# EAGLE schematic cw-lite-main (EAGLE 9.5.0)
ChipWhisperer-Lite ChipWhisperer-Lite is a side-channel analysis and gltiching platform for embedded security research. ChipWhisperer-Lite is a product of NewAE Technology Inc.
REV: -03
Assembly variants: normal

## Sheet 1 of 8
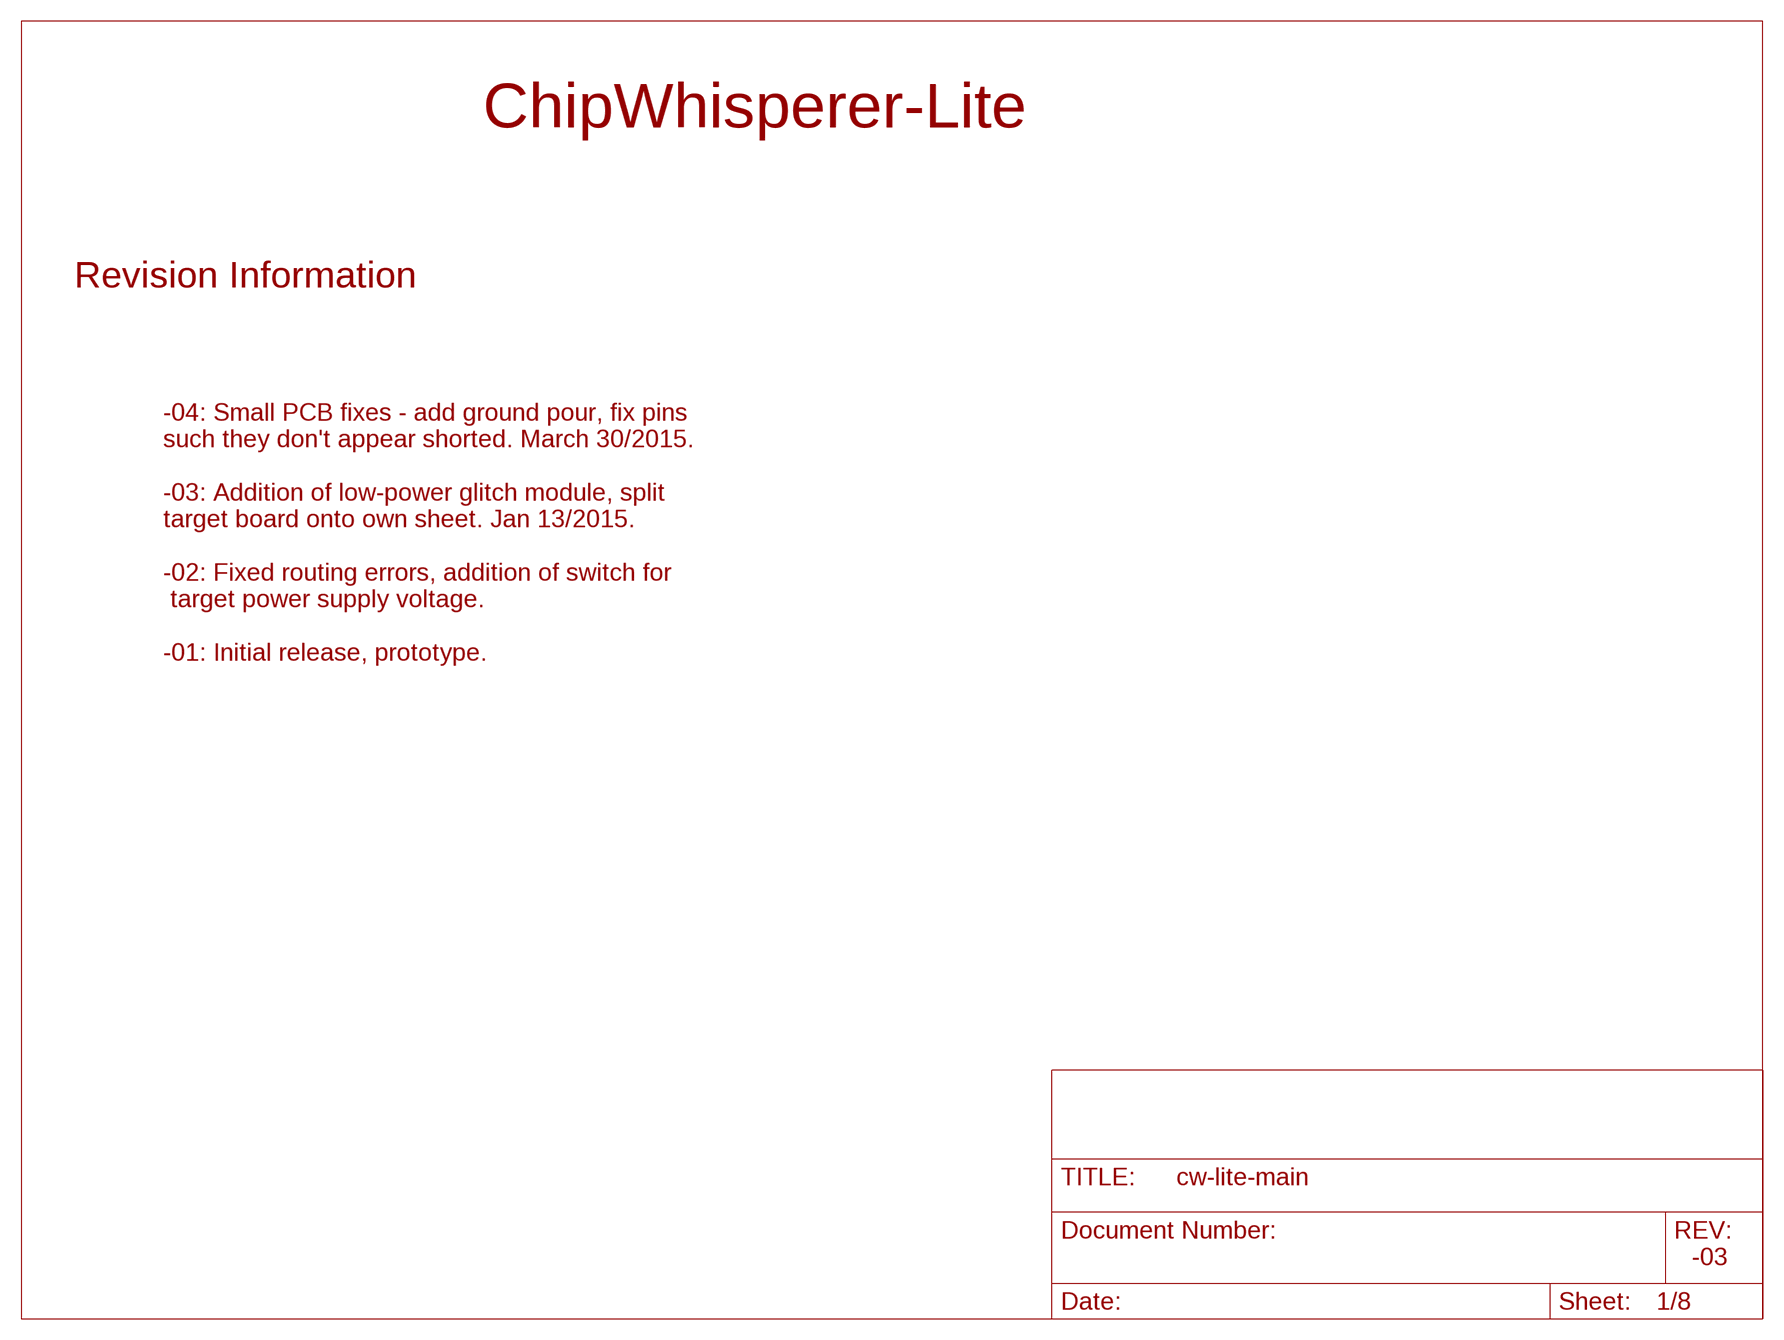
[diagram p0: schematic, sheet 1]

### Notes on the sheet
- ChipWhisperer-Lite
- Revision Information
- -04: Small PCB fixes - add ground pour, fix pins
  such they don't appear shorted. March 30/2015.
  
  -03: Addition of low-power glitch module, split
  target board onto own sheet. Jan 13/2015.
  
  -02: Fixed routing errors, addition of switch for
   target power supply voltage.
  
  -01: Initial release, prototype.

## Sheet 2 of 8
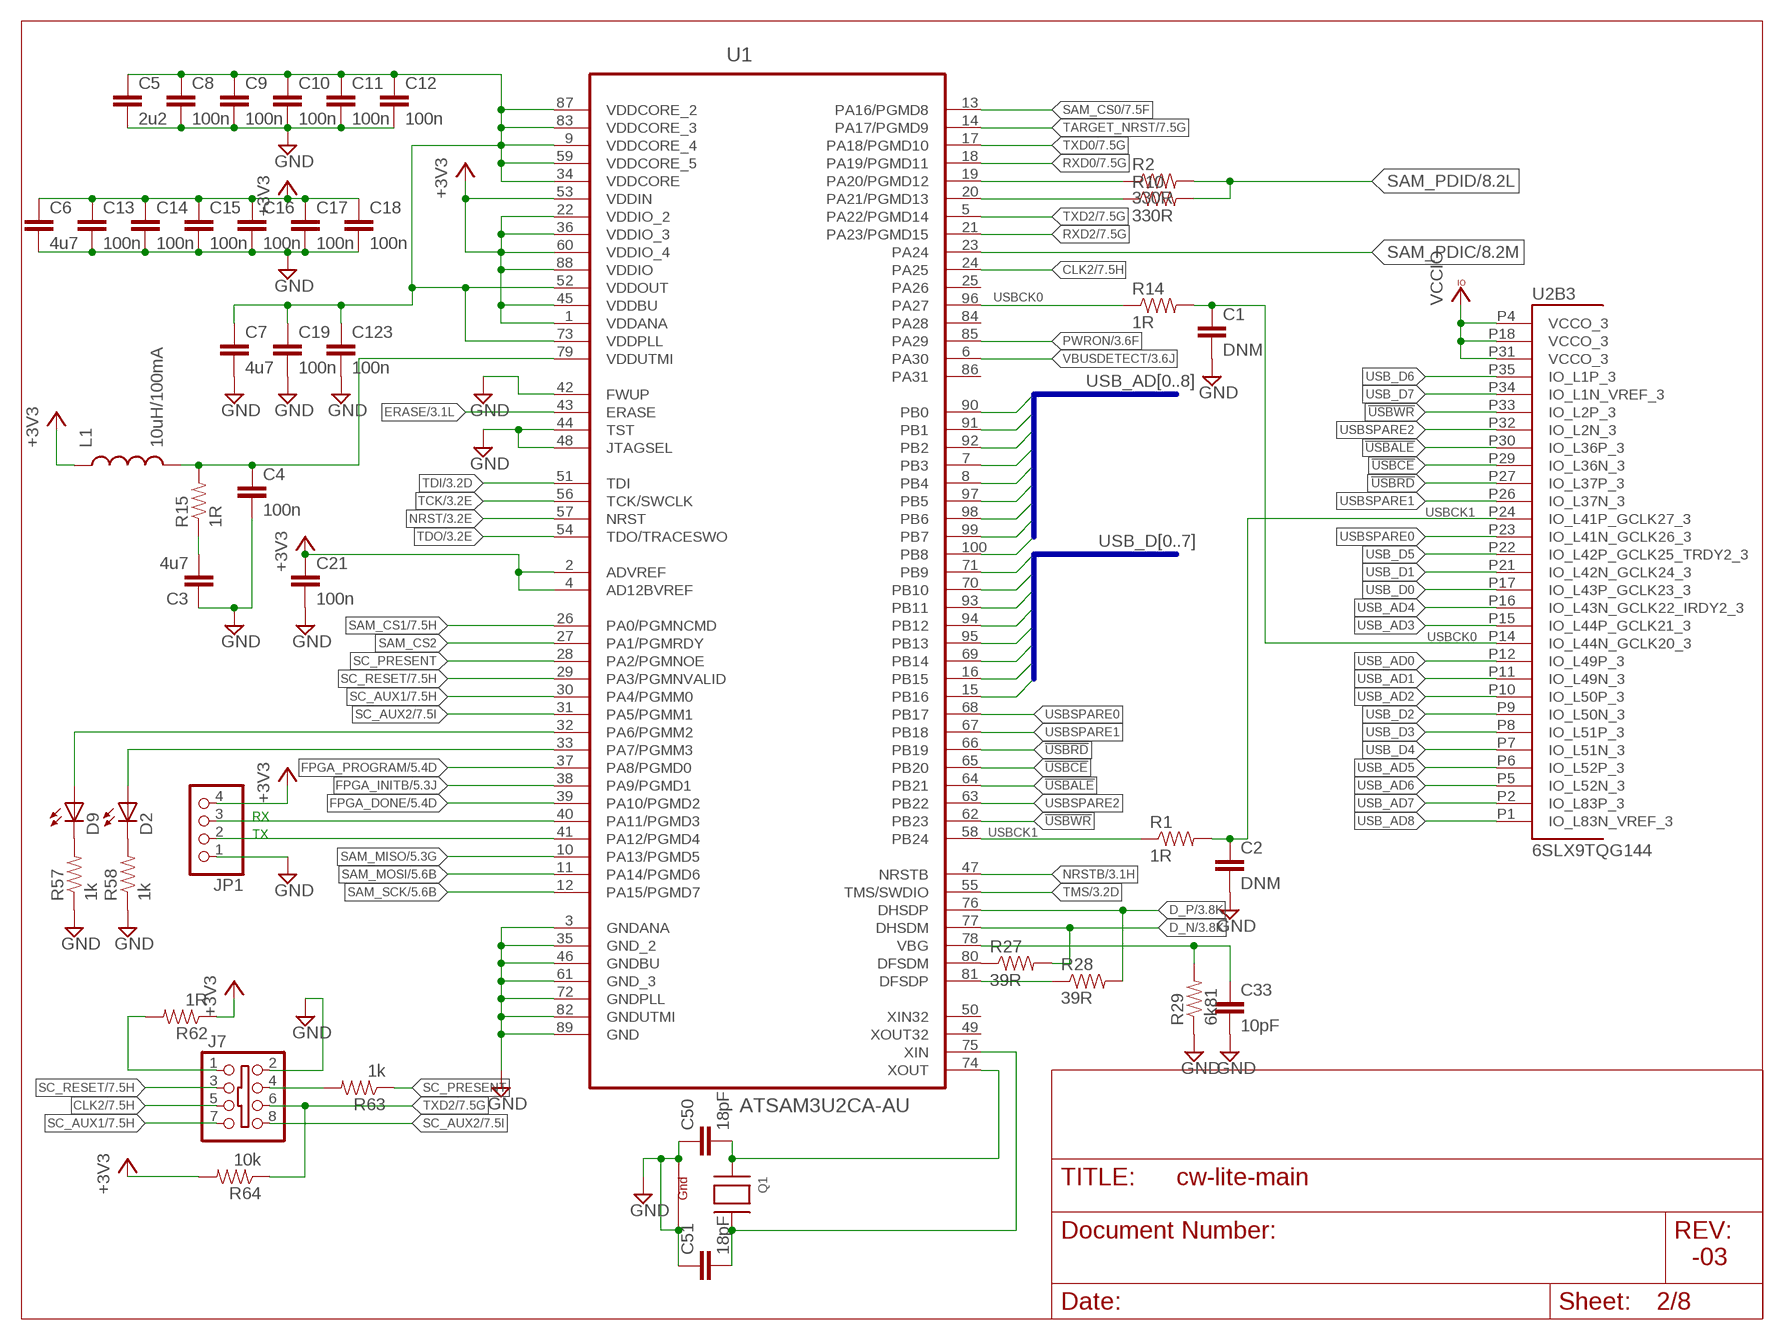
[diagram p1: schematic, sheet 2]

### Parts
C1  DNM  CAP0402-CAP  [0402C]  (not fitted in variant normal)
C2  DNM  CAP0402-CAP  [0402C]  (not fitted in variant normal)
C3  4u7  CAP0603-CAP  [0603C]
C4  100n  CAP0402-CAP  [0402C]
C5  2u2  CAP0603-CAP  [0603C]
C6  4u7  CAP0603-CAP  [0603C]
C7  4u7  CAP0603-CAP  [0603C]
C8  100n  CAP0402-CAP  [0402C]
C9  100n  CAP0402-CAP  [0402C]
C10  100n  CAP0402-CAP  [0402C]
C11  100n  CAP0402-CAP  [0402C]
C12  100n  CAP0402-CAP  [0402C]
C13  100n  CAP0402-CAP  [0402C]
C14  100n  CAP0402-CAP  [0402C]
C15  100n  CAP0402-CAP  [0402C]
C16  100n  CAP0402-CAP  [0402C]
C17  100n  CAP0402-CAP  [0402C]
C18  100n  CAP0402-CAP  [0402C]
C19  100n  CAP0402-CAP  [0402C]
C21  100n  CAP0402-CAP  [0402C]
C33  10pF  CAP0603-CAP  [0603C]
C50  18pF  CAP0402-CAP  [0402C]
C51  18pF  CAP0402-CAP  [0402C]
C123  100n  CAP0402-CAP  [0402C]
D2  LED0603  [LED-0603]
D9  LED0603  [LED-0603]
J7  SHROUD_2X4EDGE  [PINSHRD_EDGE_2X04.PAC]  (not fitted in variant normal)
JP1  PINHD-1X4  [1X04]  (not fitted in variant normal)
L1  10uH/100mA  INDUCTOR0603  [0603]
Q1  XTAL-4ABM8G  [NX3225]
R1  1R  RES0402-RES  [0402R]
R2  330R  RES0402-RES  [0402R]
R10  330R  RES0402-RES  [0402R]
R14  1R  RES0402-RES  [0402R]
R15  1R  RES0603-RES  [0603R]
R27  39R  RES0603-RES  [0603R]
R28  39R  RES0603-RES  [0603R]
R29  6k81  RES0402-RES  [0402R]
R57  1k  RES0603-RES  [0603R]
R58  1k  RES0603-RES  [0603R]
R62  1R  RES0603-RES  [0603R]
R63  1k  RES0603-RES  [0603R]
R64  10k  RES0603-RES  [0603R]
U1  ATSAM3U2CA-AU  [QFP50P1600X1600X160-100N]
U2  6SLX9TQG144  [TQ144]

### Nets
!USBALE: U1.64(PB21) U2.P30(B3:IO_L36P_3)
!USBCE: U1.65(PB20) U2.P29(B3:IO_L36N_3)
!USBRD: U1.66(PB19) U2.P27(B3:IO_L37P_3)
!USBWR: U1.62(PB23) U2.P33(B3:IO_L2P_3)
+3V3 [power]: C6.1 C13.1 C14.1 C15.1 C16.1 C17.1 C18.1 C21.1 JP1.4 L1.1 R62.1 R64.2 U1.1(VDDANA) U1.2(ADVREF) U1.4(AD12BVREF) U1.22(VDDIO_2) U1.36(VDDIO_3) U1.45(VDDBU) U1.53(VDDIN) U1.60(VDDIO_4) U1.88(VDDIO) ; also sheet 3,4
CLK2: J7.5 U1.24(PA25) ; also sheet 7
D_N [USB Differential]: R27.2 U1.77(DHSDM) ; also sheet 3
D_P [USB Differential]: R28.2 U1.76(DHSDP) ; also sheet 3
ERASE: U1.43(ERASE) ; also sheet 3
FPGA_DONE: U1.39(PA10/PGMD2) ; also sheet 5
FPGA_INITB: U1.38(PA9/PGMD1) ; also sheet 5
FPGA_PROGRAM: U1.37(PA8/PGMD0) ; also sheet 5
GND: C1.2 C2.2 C3.1 C4.2 C5.2 C6.2 C7.2 C8.2 C9.2 C10.2 C11.2 C12.2 C13.2 C14.2 C15.2 C16.2 C17.2 C18.2 C19.2 C21.2 C33.2 C50.1 C51.1 C123.2 J7.2 JP1.1 Q1.2(G1) Q1.4(G2) R29.1 R57.1 R58.1 U1.3(GNDANA) U1.35(GND_2) U1.42(FWUP) U1.44(TST) U1.46(GNDBU) U1.48(JTAGSEL) U1.61(GND_3) U1.72(GNDPLL) U1.82(GNDUTMI) U1.89(GND) ; also sheet 3,4,5,6,7,8
N$1: R14.1 U1.96(PA27)
N$2: JP1.3 U1.40(PA11/PGMD3)
N$3: R1.1 U1.58(PB24)
N$4: JP1.2 U1.41(PA12/PGMD4)
N$6: R2.1 U1.19(PA20/PGMD12)
N$13: R10.1 U1.20(PA21/PGMD13)
N$17: C3.2 R15.1
N$18: C4.1 L1.2 R15.2 U1.79(VDDUTMI)
N$23: R27.1 U1.80(DFSDM)
N$25 [power]: C5.1 C7.1 C8.1 C9.1 C10.1 C11.1 C12.1 C19.1 C123.1 U1.9(VDDCORE_4) U1.34(VDDCORE) U1.52(VDDOUT) U1.59(VDDCORE_5) U1.73(VDDPLL) U1.83(VDDCORE_3) U1.87(VDDCORE_2)
N$26: R28.1 U1.81(DFSDP)
N$28: C33.1 R29.2 U1.78(VBG)
N$100: C51.2 Q1.3(X2) U1.75(XIN)
N$105: C50.2 Q1.1(X1) U1.74(XOUT)
N$114: D9.A U1.32(PA6/PGMM2)
N$115: D2.A U1.33(PA7/PGMM3)
N$135: D9.C R57.2
N$138: D2.C R58.2
N$139: J7.1 R62.2
N$143: J7.4 R63.2
NRST: U1.57(NRST) ; also sheet 3
NRSTB: U1.47(NRSTB) ; also sheet 3
PWRON: U1.85(PA29) ; also sheet 3
RXD0: U1.18(PA19/PGMD11) ; also sheet 7
RXD2: U1.21(PA23/PGMD15) ; also sheet 7
SAM_CS0: U1.13(PA16/PGMD8) ; also sheet 7
SAM_CS1: U1.26(PA0/PGMNCMD) ; also sheet 7
SAM_CS2: U1.27(PA1/PGMRDY)
SAM_MISO: U1.10(PA13/PGMD5) ; also sheet 5
SAM_MOSI: U1.11(PA14/PGMD6) ; also sheet 5
SAM_PDIC: U1.23(PA24) ; also sheet 8
SAM_PDID: R2.2 R10.2 ; also sheet 8
SAM_SCK: U1.12(PA15/PGMD7) ; also sheet 5
SC_AUX1: J7.7 U1.30(PA4/PGMM0) ; also sheet 7
SC_AUX2: J7.8 U1.31(PA5/PGMM1) ; also sheet 7
SC_PRESENT: R63.1 U1.28(PA2/PGMNOE)
SC_RESET: J7.3 U1.29(PA3/PGMNVALID) ; also sheet 7
TARGET_NRST: U1.14(PA17/PGMD9) ; also sheet 7
TCK: U1.56(TCK/SWCLK) ; also sheet 3
TDI: U1.51(TDI) ; also sheet 3
TDO: U1.54(TDO/TRACESWO) ; also sheet 3
TMS: U1.55(TMS/SWDIO) ; also sheet 3
TXD0: U1.17(PA18/PGMD10) ; also sheet 7
TXD2: J7.6 R64.1 U1.5(PA22/PGMD14) ; also sheet 7
USB_AD0: U1.90(PB0) U2.P12(B3:IO_L49P_3)
USB_AD1: U1.91(PB1) U2.P11(B3:IO_L49N_3)
USB_AD2: U1.92(PB2) U2.P10(B3:IO_L50P_3)
USB_AD3: U1.7(PB3) U2.P15(B3:IO_L44P_GCLK21_3)
USB_AD4: U1.8(PB4) U2.P16(B3:IO_L43N_GCLK22_IRDY2_3)
USB_AD5: U1.97(PB5) U2.P6(B3:IO_L52P_3)
USB_AD6: U1.98(PB6) U2.P5(B3:IO_L52N_3)
USB_AD7: U1.99(PB7) U2.P2(B3:IO_L83P_3)
USB_AD8: U1.100(PB8) U2.P1(B3:IO_L83N_VREF_3)
USB_D0: U1.71(PB9) U2.P17(B3:IO_L43P_GCLK23_3)
USB_D1: U1.70(PB10) U2.P21(B3:IO_L42N_GCLK24_3)
USB_D2: U1.93(PB11) U2.P9(B3:IO_L50N_3)
USB_D3: U1.94(PB12) U2.P8(B3:IO_L51P_3)
USB_D4: U1.95(PB13) U2.P7(B3:IO_L51N_3)
USB_D5: U1.69(PB14) U2.P22(B3:IO_L42P_GCLK25_TRDY2_3)
USB_D6: U1.16(PB15) U2.P35(B3:IO_L1P_3)
USB_D7: U1.15(PB16) U2.P34(B3:IO_L1N_VREF_3)
USBCK0: C1.1 R14.2 U2.P14(B3:IO_L44N_GCLK20_3)
USBCK1: C2.1 R1.2 U2.P24(B3:IO_L41P_GCLK27_3)
USBSPARE0: U1.68(PB17) U2.P23(B3:IO_L41N_GCLK26_3)
USBSPARE1: U1.67(PB18) U2.P26(B3:IO_L37N_3)
USBSPARE2: U1.63(PB22) U2.P32(B3:IO_L2N_3)
VBUSDETECT: U1.6(PA30) ; also sheet 3
VCCIO [power]: U2.P4(B3:VCCO_3) U2.P18(B3:VCCO_3) U2.P31(B3:VCCO_3) ; also sheet 3,4,5,6,7,8
Unconnected: U1.25(PA26) U1.49(XOUT32) U1.50(XIN32) U1.84(PA28) U1.86(PA31)

### Buses
USB_AD[0..8]
USB_D[0..7]

### Notes on the sheet
- RX
- TX

## Sheet 3 of 8
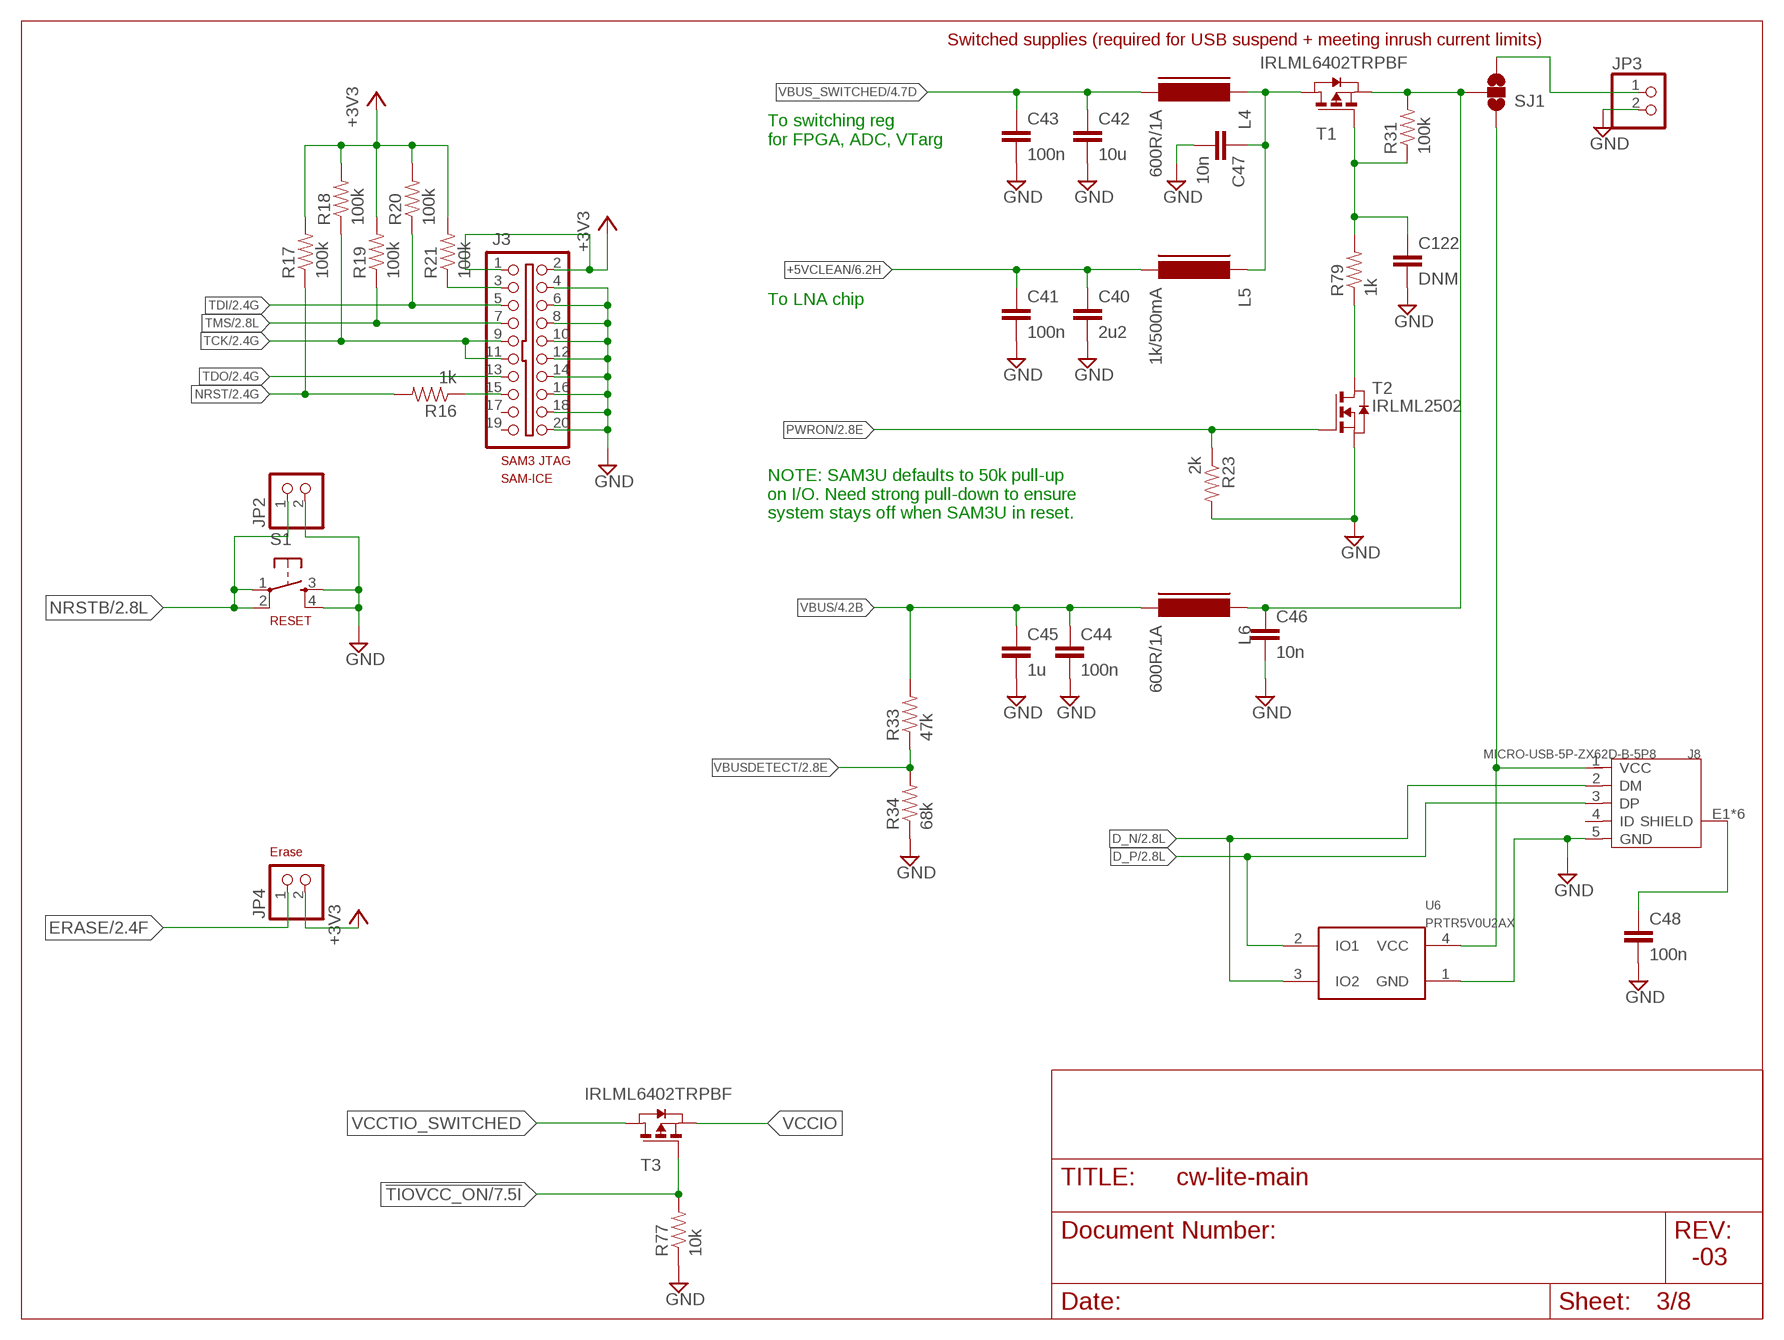
[diagram p2: schematic, sheet 3]

### Parts
C40  2u2  CAP0603-CAP  [0603C]
C41  100n  CAP0603-CAP  [0603C]
C42  10u  CAP0603-CAP  [0603C]
C43  100n  CAP0603-CAP  [0603C]
C44  100n  CAP0603-CAP  [0603C]
C45  1u  CAP0603-CAP  [0603C]
C46  10n  CAP0603-CAP  [0603C]
C47  10n  CAP0603-CAP  [0603C]
C48  100n  CAP0603-CAP  [0603C]
C122  DNM  CAP0603-CAP  [0603C]  (not fitted in variant normal)
J3  SHROUD_2X10-SHROUDED  [PINSHRD_PTH_2X10]  (not fitted in variant normal)
J8  MICRO-USB-5P-ZX62D-B-5P8  [B-SMD-5P-TH]
JP2  PINHD-1X2  [1X02]  (not fitted in variant normal)
JP3  PINHD-1X2  [1X02]  (not fitted in variant normal)
JP4  PINHD-1X2  [1X02]  (not fitted in variant normal)
L4  600R/1A  FERRITE-0603  [FB603]
L5  1k/500mA  FERRITE-0603  [FB603]
L6  600R/1A  FERRITE-0603  [FB603]
R16  1k  RES0402-RES  [0402R]
R17  100k  RES0402-RES  [0402R]
R18  100k  RES0402-RES  [0402R]
R19  100k  RES0402-RES  [0402R]
R20  100k  RES0402-RES  [0402R]
R21  100k  RES0402-RES  [0402R]
R23  2k  RES0603-RES  [0603R]
R31  100k  RES0402-RES  [0402R]
R33  47k  RES0402-RES  [0402R]
R34  68k  RES0402-RES  [0402R]
R77  10k  RES0402-RES  [0402R]
R79  1k  RES0603-RES  [0603R]
S1  TAC_SWITCHSMD  [TACTILE_SWITCH_SMD]  (not fitted in variant normal)
SJ1  SOLDERJUMPER_2WAYPASTE1&2  [SJ_3_PASTE1&2]
T1  IRLML6402TRPBF  PMOSSOT23  [SOT-23]
T2  IRLML2502  NMOSSOT23  [SOT-23]
T3  IRLML6402TRPBF  PMOSSOT23  [SOT-23]
U6  PRTR5V0U2AX  [SOT143B]

### Nets
!TIOVCC_ON: R77.2 T3.3(G) ; also sheet 7
+3V3 [power]: J3.1 J3.2 JP4.2 R17.2 R18.2 R19.2 R20.2 R21.2 ; also sheet 2,4
+5VCLEAN: C40.1 C41.1 L5.2 ; also sheet 6
D_N [USB Differential]: J8.2(DM) U6.3(IO2) ; also sheet 2
D_P [USB Differential]: J8.3(DP) U6.2(IO1) ; also sheet 2
ERASE: JP4.1 ; also sheet 2
GND: C40.2 C41.2 C42.2 C43.2 C44.2 C45.2 C46.2 C47.2 C48.2 C122.2 J3.4 J3.6 J3.8 J3.10 J3.12 J3.14 J3.16 J3.18 J3.20 J8.5(GND) JP2.2 JP3.2 R23.2 R34.1 R77.1 S1.3 S1.4 T2.2(S) U6.1(GND) ; also sheet 2,4,5,6,7,8
N$16: J3.3 R21.1
N$21: J3.15 R16.1
N$27: JP3.1 SJ1.3
N$29: C46.1 L6.1 R31.2 SJ1.2 T1.2(S)
N$31: J8.1(VCC) SJ1.1 U6.4(VCC)
N$32: C47.1 L4.1 L5.1 T1.1(D)
N$33: C122.1 R31.1 R79.2 T1.3(G)
N$34: R79.1 T2.1(D)
N$35: C48.1 J8.E1(SHIELD) J8.E2(SHIELD) J8.P$1(SHIELD) J8.P$2(SHIELD) J8.P$3(SHIELD) J8.P$4(SHIELD)
NRST: R16.2 R17.1 ; also sheet 2
NRSTB: JP2.1 S1.1 S1.2 ; also sheet 2
PWRON: R23.1 T2.3(G) ; also sheet 2
TCK: J3.9 J3.11 R18.1 ; also sheet 2
TDI: J3.5 R20.1 ; also sheet 2
TDO: J3.13 ; also sheet 2
TMS: J3.7 R19.1 ; also sheet 2
VBUS: C44.1 C45.1 L6.2 R33.2 ; also sheet 4
VBUS_SWITCHED: C42.1 C43.1 L4.2 ; also sheet 4
VBUSDETECT: R33.1 R34.2 ; also sheet 2
VCCIO [power]: T3.2(S) ; also sheet 2,4,5,6,7,8
VCCTIO_SWITCHED [power]: T3.1(D) ; also sheet 8
Unconnected: J3.17 J3.19 J8.4(ID)

### Notes on the sheet
- Switched supplies (required for USB suspend + meeting inrush current limits)
- To switching reg
  for FPGA, ADC, VTarg
- To LNA chip
- SAM3 JTAG
- SAM-ICE
- NOTE: SAM3U defaults to 50k pull-up
  on I/O. Need strong pull-down to ensure
  system stays off when SAM3U in reset.
- RESET
- Erase

## Sheet 4 of 8
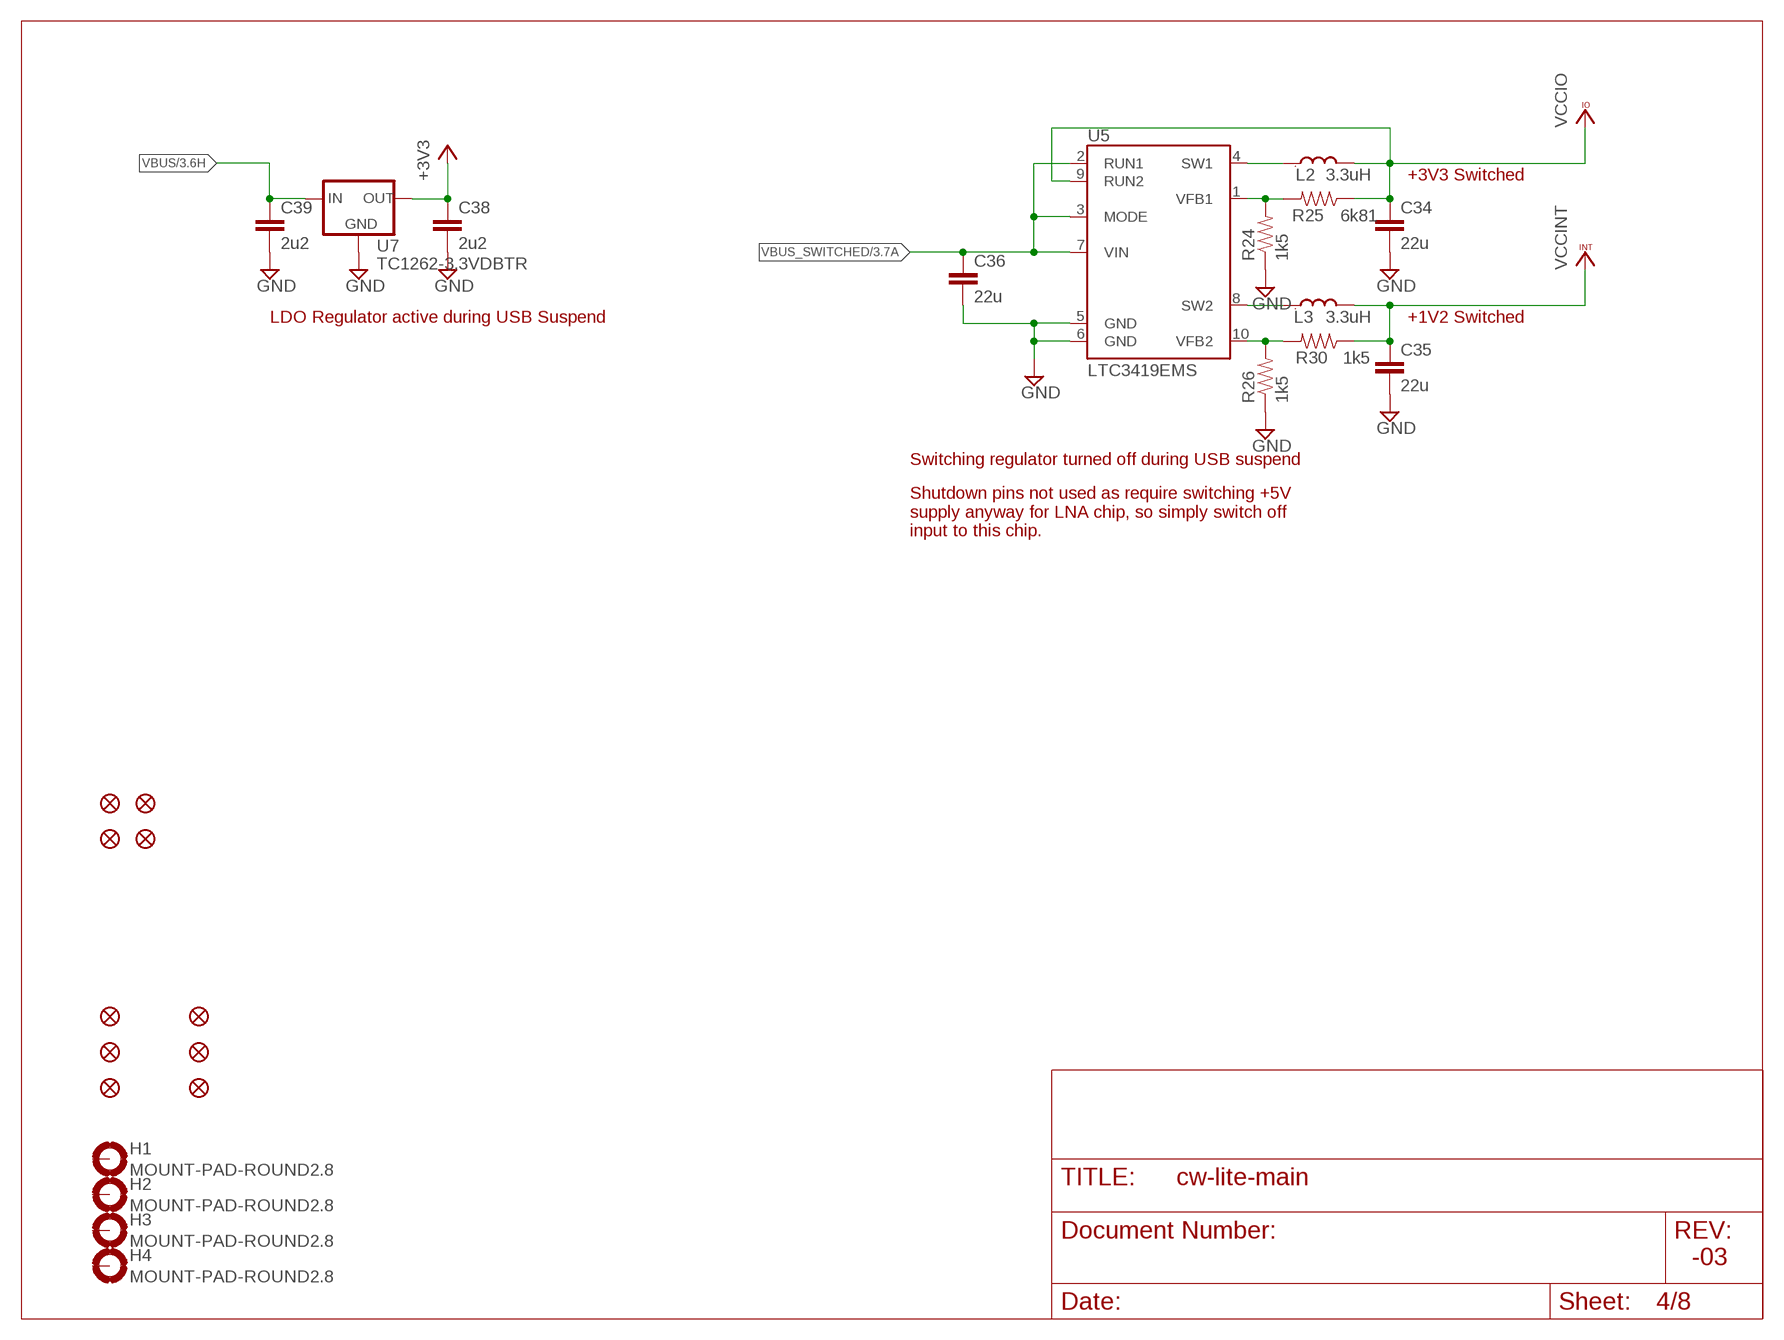
[diagram p3: schematic, sheet 4]

### Parts
C34  22u  CAP0805  [0805]
C35  22u  CAP0805  [0805]
C36  22u  CAP0805  [0805]
C38  2u2  CAP0603-CAP  [0603C]
C39  2u2  CAP0603-CAP  [0603C]
FID1  FIDUCIAL1.5X3  [FIDUCIAL-1.5X3]
FID2  FIDUCIAL1.5X3  [FIDUCIAL-1.5X3]
FID3  FIDUCIAL1.5X3  [FIDUCIAL-1.5X3]
FID4  FIDUCIAL1.5X3  [FIDUCIAL-1.5X3]
FID5  FIDUCIAL1.5X3  [FIDUCIAL-1.5X3]
FID6  FIDUCIAL1.5X3  [FIDUCIAL-1.5X3]
H1  MOUNT-PAD-ROUND2.8  [2,8-PAD]
H2  MOUNT-PAD-ROUND2.8  [2,8-PAD]
H3  MOUNT-PAD-ROUND2.8  [2,8-PAD]
H4  MOUNT-PAD-ROUND2.8  [2,8-PAD]
L2  3.3uH  L_VLS3015  [VLS3015]
L3  3.3uH  L_VLS3015  [VLS3015]
MFID1  FIDUCIALUFIDUCIAL  [MICRO-FIDUCIAL]
MFID2  FIDUCIALUFIDUCIAL  [MICRO-FIDUCIAL]
MFID3  FIDUCIALUFIDUCIAL  [MICRO-FIDUCIAL]
MFID4  FIDUCIALUFIDUCIAL  [MICRO-FIDUCIAL]
R24  1k5  RES0402-RES  [0402R]
R25  6k81  RES0402-RES  [0402R]
R26  1k5  RES0402-RES  [0402R]
R30  1k5  RES0402-RES  [0402R]
U5  LTC3419EMS  [MSOP10]
U7  TC1262-3.3VDBTR  V_REG_MIC2920  [SOT223]

### Nets
+3V3 [power]: C38.1 U7.3(OUT) ; also sheet 2,3
FB_1V2: R26.2 R30.2 U5.10(VFB2)
FB_3V3: R24.2 R25.2 U5.1(VFB1)
GND: C34.2 C35.2 C36.2 C38.2 C39.2 R24.1 R26.1 U5.5(GND) U5.6(GND) U7.2(GND) ; also sheet 2,3,5,6,7,8
N$15: L2.1 U5.4(SW1)
N$24: L3.1 U5.8(SW2)
VBUS: C39.1 U7.1(IN) ; also sheet 3
VBUS_SWITCHED: C36.1 U5.2(RUN1) U5.3(MODE) U5.7(VIN) ; also sheet 3
VCCINT [power]: C35.1 L3.2 R30.1 ; also sheet 5
VCCIO [power]: C34.1 L2.2 R25.1 U5.9(RUN2) ; also sheet 2,3,5,6,7,8
Unconnected: H1.B2,8(MOUNT) H2.B2,8(MOUNT) H3.B2,8(MOUNT) H4.B2,8(MOUNT)

### Notes on the sheet
- +3V3 Switched
- LDO Regulator active during USB Suspend | +1V2 Switched
- Switching regulator turned off during USB suspend
- Shutdown pins not used as require switching +5V
  supply anyway for LNA chip, so simply switch off
  input to this chip.

## Sheet 5 of 8
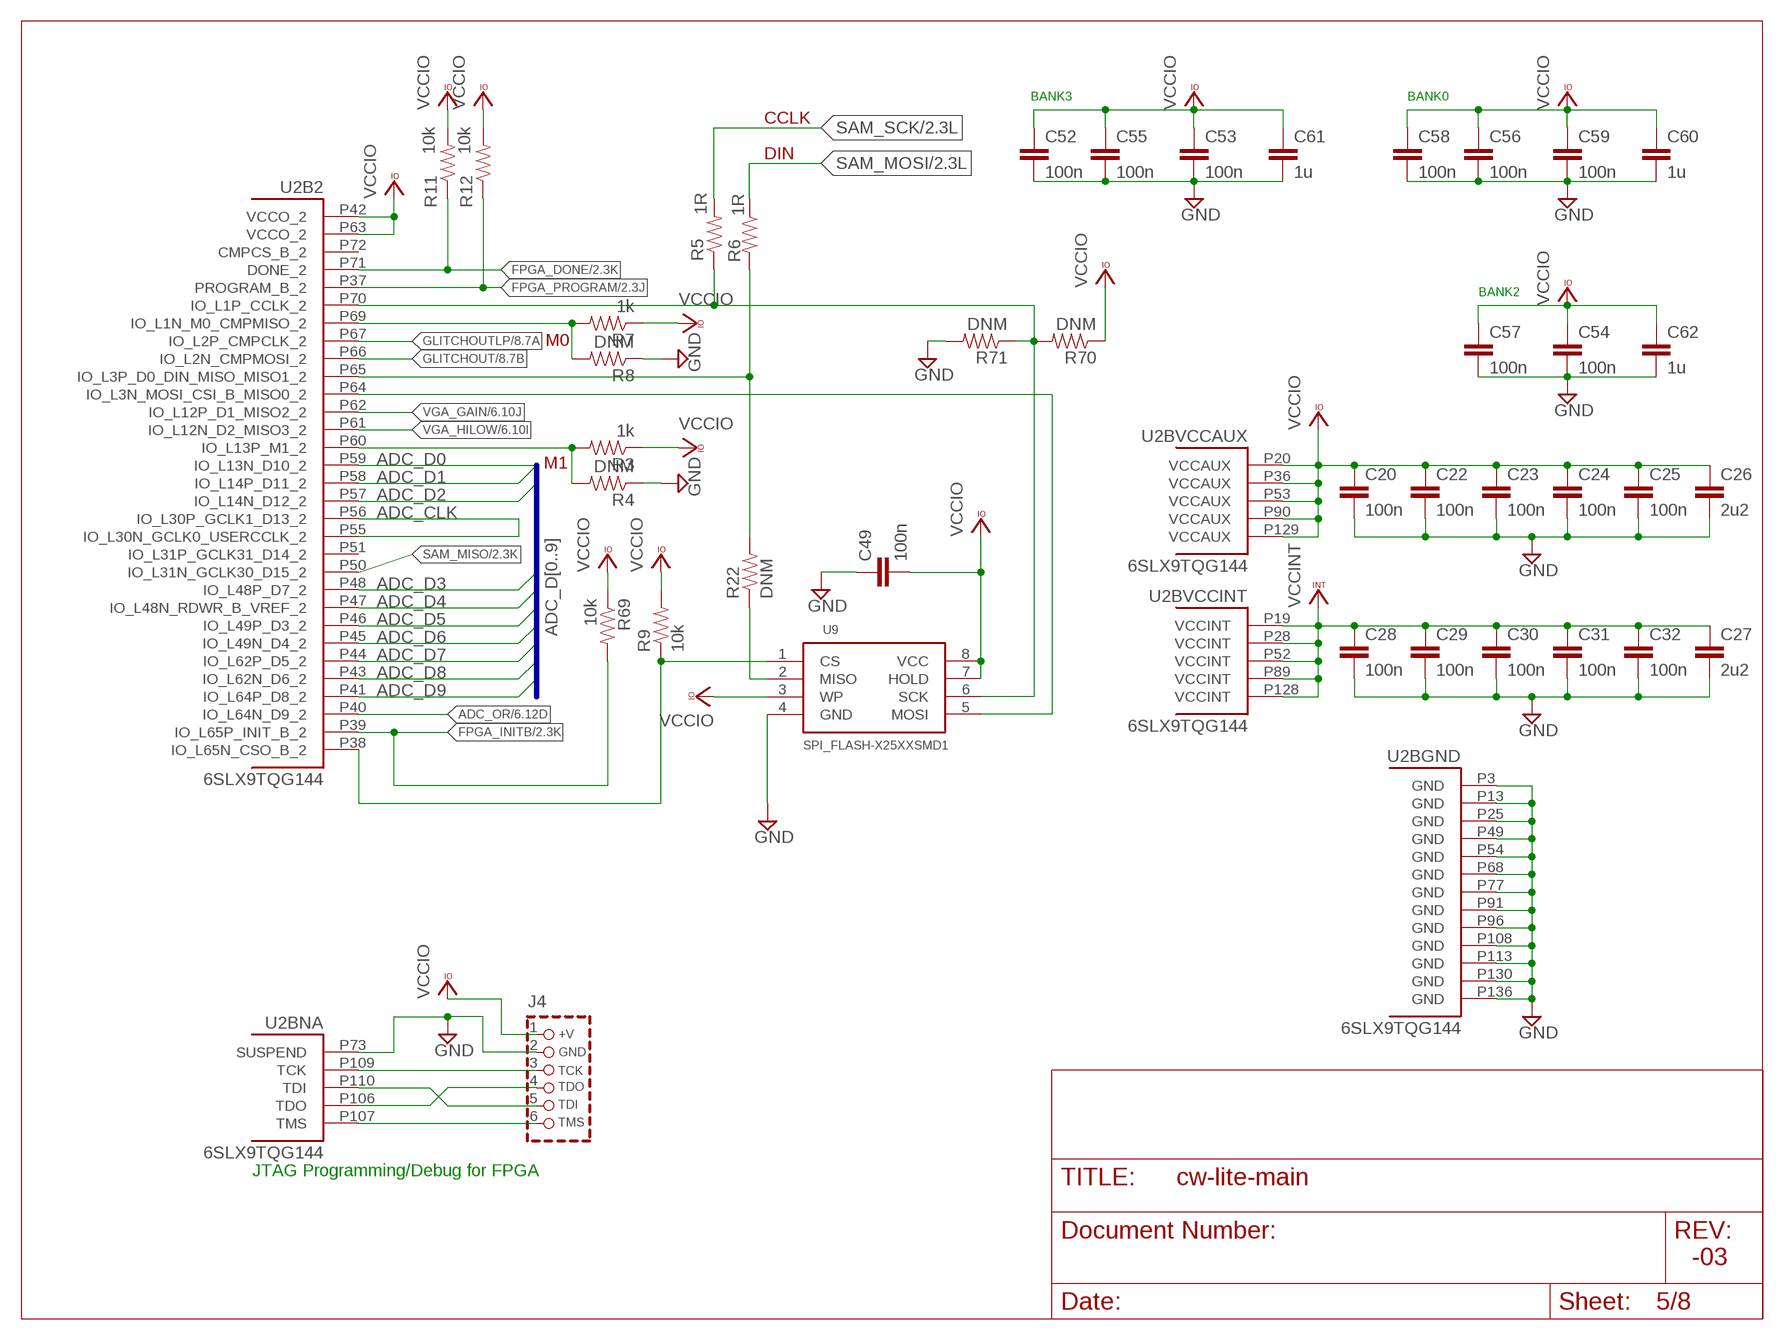
[diagram p4: schematic, sheet 5]

### Parts
C20  100n  CAP0402-CAP  [0402C]
C22  100n  CAP0402-CAP  [0402C]
C23  100n  CAP0402-CAP  [0402C]
C24  100n  CAP0402-CAP  [0402C]
C25  100n  CAP0402-CAP  [0402C]
C26  2u2  CAP0603-CAP  [0603C]
C27  2u2  CAP0603-CAP  [0603C]
C28  100n  CAP0402-CAP  [0402C]
C29  100n  CAP0402-CAP  [0402C]
C30  100n  CAP0402-CAP  [0402C]
C31  100n  CAP0402-CAP  [0402C]
C32  100n  CAP0402-CAP  [0402C]
C49  100n  CAP0603-CAP  [0603C]
C52  100n  CAP0402-CAP  [0402C]
C53  100n  CAP0402-CAP  [0402C]
C54  100n  CAP0402-CAP  [0402C]
C55  100n  CAP0402-CAP  [0402C]
C56  100n  CAP0402-CAP  [0402C]
C57  100n  CAP0402-CAP  [0402C]
C58  100n  CAP0402-CAP  [0402C]
C59  100n  CAP0402-CAP  [0402C]
C60  1u  CAP0603-CAP  [0603C]
C61  1u  CAP0603-CAP  [0603C]
C62  1u  CAP0603-CAP  [0603C]
J4  CON_HEADER_PRG_XILINX_JTAG6  [HEADER_PRG_1X06]  (not fitted in variant normal)
R3  1k  RES0603-RES  [0603R]
R4  DNM  RES0603-RES  [0603R]  (not fitted in variant normal)
R5  1R  RES0402-RES  [0402R]
R6  1R  RES0402-RES  [0402R]
R7  1k  RES0603-RES  [0603R]
R8  DNM  RES0603-RES  [0603R]  (not fitted in variant normal)
R9  10k  RES0402-RES  [0402R]
R11  10k  RES0402-RES  [0402R]
R12  10k  RES0402-RES  [0402R]
R22  DNM  RES0603-RES  [0603R]  (not fitted in variant normal)
R69  10k  RES0402-RES  [0402R]
R70  DNM  RES0402-RES  [0402R]  (not fitted in variant normal)
R71  DNM  RES0402-RES  [0402R]  (not fitted in variant normal)
U9  SPI_FLASH-X25XXSMD1  [SO08-EIAJ]  (not fitted in variant normal)

### Nets
ADC_CLK: U2.P55(B2:IO_L30N_GCLK0_USERCCLK_2) U2.P56(B2:IO_L30P_GCLK1_D13_2) ; also sheet 6
ADC_D0: U2.P59(B2:IO_L13N_D10_2) ; also sheet 6
ADC_D1: U2.P58(B2:IO_L14P_D11_2) ; also sheet 6
ADC_D2: U2.P57(B2:IO_L14N_D12_2) ; also sheet 6
ADC_D3: U2.P48(B2:IO_L48P_D7_2) ; also sheet 6
ADC_D4: U2.P47(B2:IO_L48N_RDWR_B_VREF_2) ; also sheet 6
ADC_D5: U2.P46(B2:IO_L49P_D3_2) ; also sheet 6
ADC_D6: U2.P45(B2:IO_L49N_D4_2) ; also sheet 6
ADC_D7: U2.P44(B2:IO_L62P_D5_2) ; also sheet 6
ADC_D8: U2.P43(B2:IO_L62N_D6_2) ; also sheet 6
ADC_D9: U2.P41(B2:IO_L64P_D8_2) ; also sheet 6
ADC_OR: U2.P40(B2:IO_L64N_D9_2) ; also sheet 6
FPGA_DONE: R11.1 U2.P71(B2:DONE_2) ; also sheet 2
FPGA_INITB: R69.2 U2.P39(B2:IO_L65P_INIT_B_2) ; also sheet 2
FPGA_PROGRAM: R12.1 U2.P37(B2:PROGRAM_B_2) ; also sheet 2
GLITCHOUT: U2.P66(B2:IO_L2N_CMPMOSI_2) ; also sheet 8
GLITCHOUTLP: U2.P67(B2:IO_L2P_CMPCLK_2) ; also sheet 8
GND: C20.2 C22.2 C23.2 C24.2 C25.2 C26.2 C27.2 C28.2 C29.2 C30.2 C31.2 C32.2 C49.1 C52.2 C53.2 C54.2 C55.2 C56.2 C57.2 C58.2 C59.2 C60.2 C61.2 C62.2 J4.2(GND) R4.1 R8.1 R71.2 U2.P3(BGND:GND) U2.P13(BGND:GND) U2.P25(BGND:GND) U2.P49(BGND:GND) U2.P54(BGND:GND) U2.P68(BGND:GND) U2.P73(BNA:SUSPEND) U2.P77(BGND:GND) U2.P91(BGND:GND) U2.P96(BGND:GND) U2.P108(BGND:GND) U2.P113(BGND:GND) U2.P130(BGND:GND) U2.P136(BGND:GND) U9.4(GND) ; also sheet 2,3,4,6,7,8
N$5: R5.1 R70.2 R71.1 U2.P70(B2:IO_L1P_CCLK_2) U9.6(SCK)
N$7: R9.1 U2.P38(B2:IO_L65N_CSO_B_2) U9.1(CS)
N$8: R3.2 R4.2 U2.P60(B2:IO_L13P_M1_2)
N$9: R7.2 R8.2 U2.P69(B2:IO_L1N_M0_CMPMISO_2)
N$10: U2.P64(B2:IO_L3N_MOSI_CSI_B_MISO0_2) U9.5(MOSI)
N$11: R6.2 R22.2 U2.P65(B2:IO_L3P_D0_DIN_MISO_MISO1_2)
N$12: R22.1 U9.2(MISO)
N$30: J4.6(TMS) U2.P107(BNA:TMS)
N$36: J4.5(TDI) U2.P110(BNA:TDI)
N$37: J4.4(TDO) U2.P106(BNA:TDO)
N$38: J4.3(TCK) U2.P109(BNA:TCK)
SAM_MISO: U2.P50(B2:IO_L31N_GCLK30_D15_2) ; also sheet 2
SAM_MOSI: R6.1 ; also sheet 2
SAM_SCK: R5.2 ; also sheet 2
VCCINT [power]: C27.1 C28.1 C29.1 C30.1 C31.1 C32.1 U2.P19(BVCCINT:VCCINT) U2.P28(BVCCINT:VCCINT) U2.P52(BVCCINT:VCCINT) U2.P89(BVCCINT:VCCINT) U2.P128(BVCCINT:VCCINT) ; also sheet 4
VCCIO [power]: C20.1 C22.1 C23.1 C24.1 C25.1 C26.1 C49.2 C52.1 C53.1 C54.1 C55.1 C56.1 C57.1 C58.1 C59.1 C60.1 C61.1 C62.1 J4.1(+V) R3.1 R7.1 R9.2 R11.2 R12.2 R69.1 R70.1 U2.P20(BVCCAUX:VCCAUX) U2.P36(BVCCAUX:VCCAUX) U2.P42(B2:VCCO_2) U2.P53(BVCCAUX:VCCAUX) U2.P63(B2:VCCO_2) U2.P90(BVCCAUX:VCCAUX) U2.P129(BVCCAUX:VCCAUX) U9.3(WP) U9.7(HOLD) U9.8(VCC) ; also sheet 2,3,4,6,7,8
VGA_GAIN: U2.P62(B2:IO_L12P_D1_MISO2_2) ; also sheet 6
VGA_HILOW: U2.P61(B2:IO_L12N_D2_MISO3_2) ; also sheet 6
Unconnected: U2.P51(B2:IO_L31P_GCLK31_D14_2) U2.P72(B2:CMPCS_B_2)

### Buses
ADC_D[0..9]

### Notes on the sheet
- BANK3 | BANK0
- CCLK
- DIN
- BANK2
- M0
- M1
- JTAG Programming/Debug for FPGA

## Sheet 6 of 8
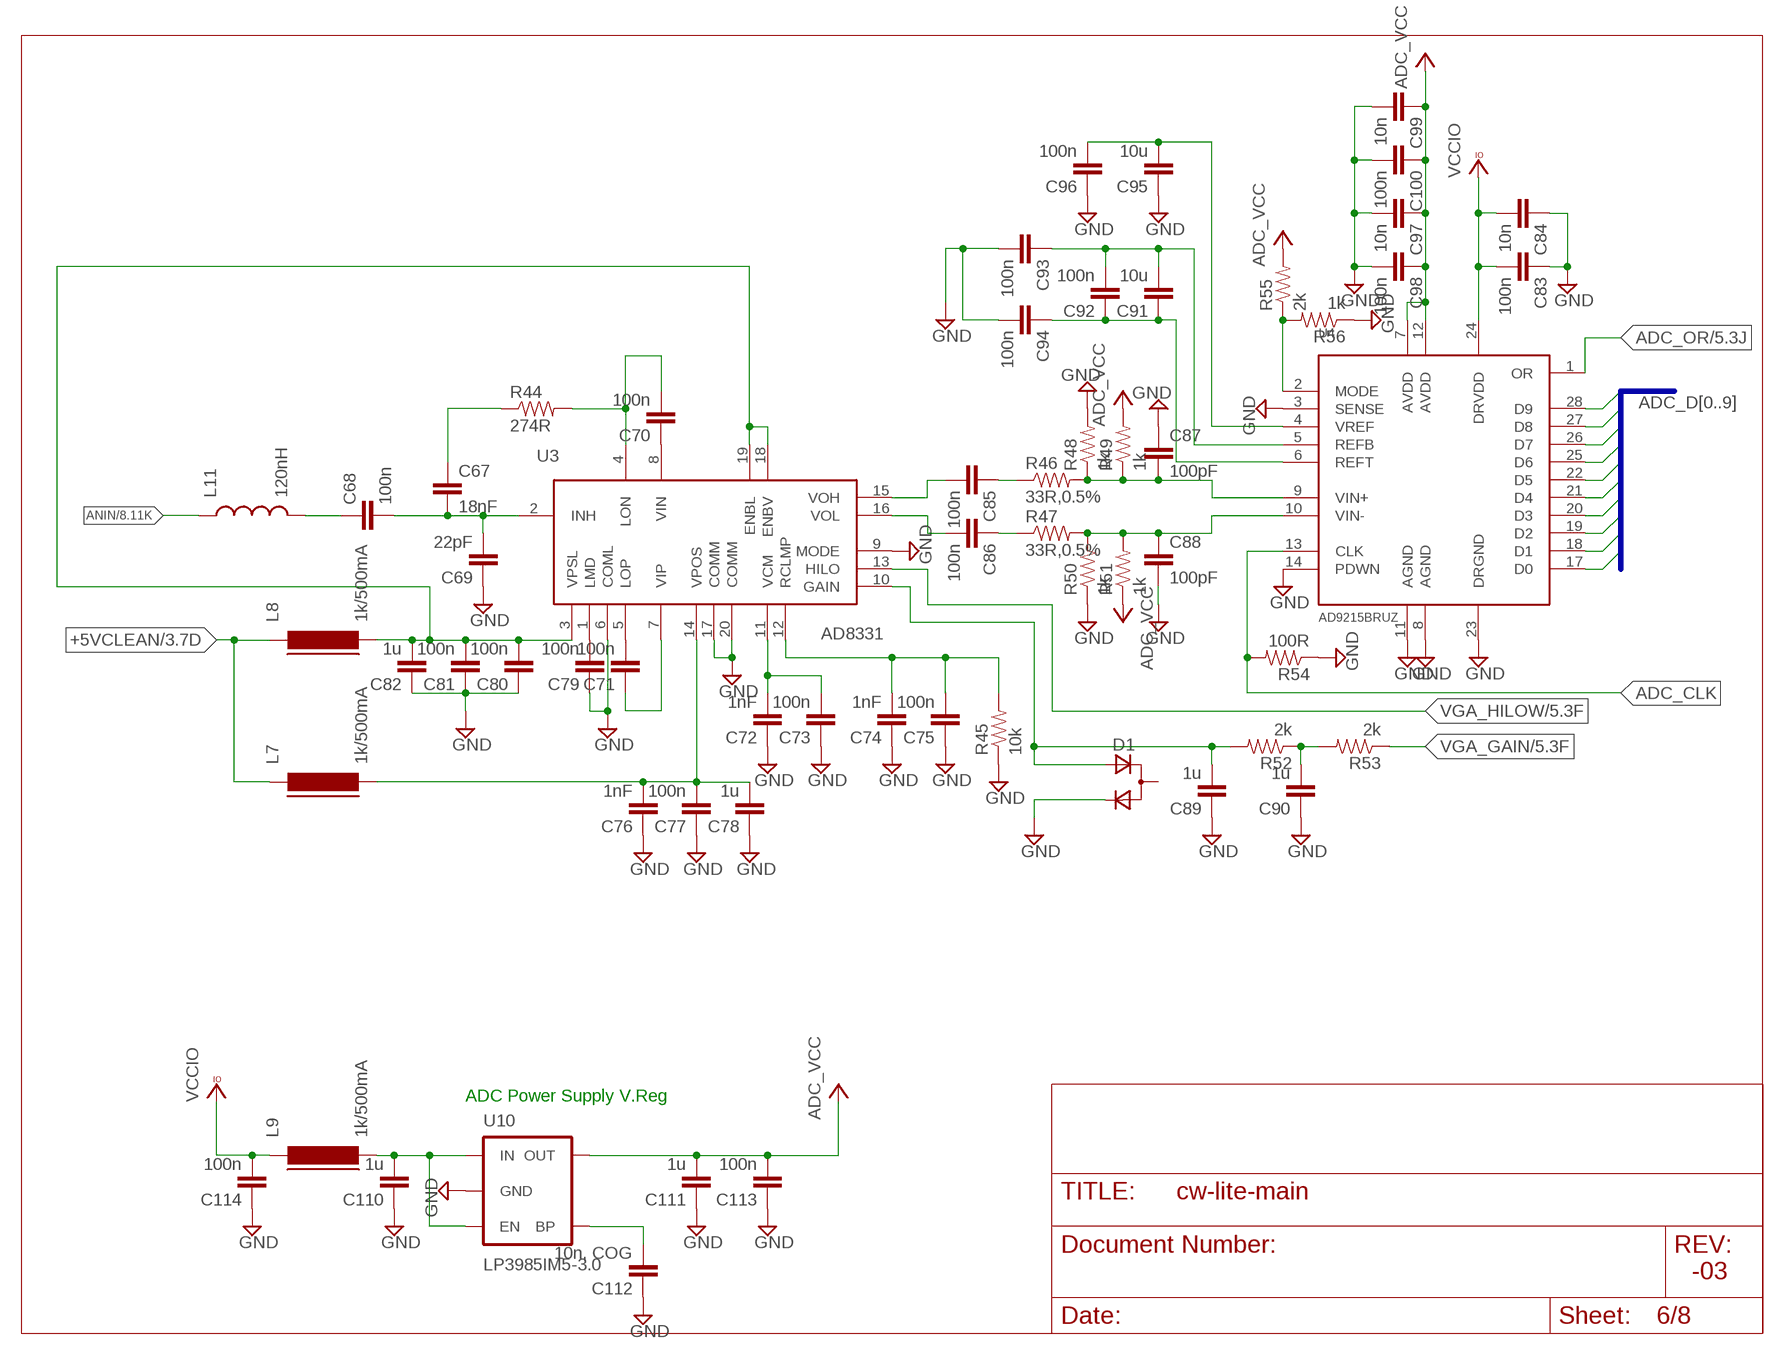
[diagram p5: schematic, sheet 6]

### Parts
C67  18nF  CAP0603-CAP  [0603C]
C68  100n  CAP0603-CAP  [0603C]
C69  22pF  CAP0603-CAP  [0603C]
C70  100n  CAP0402-CAP  [0402C]
C71  100n  CAP0402-CAP  [0402C]
C72  1nF  CAP0402-CAP  [0402C]
C73  100n  CAP0402-CAP  [0402C]
C74  1nF  CAP0402-CAP  [0402C]
C75  100n  CAP0402-CAP  [0402C]
C76  1nF  CAP0402-CAP  [0402C]
C77  100n  CAP0402-CAP  [0402C]
C78  1u  CAP0603-CAP  [0603C]
C79  100n  CAP0402-CAP  [0402C]
C80  100n  CAP0402-CAP  [0402C]
C81  100n  CAP0402-CAP  [0402C]
C82  1u  CAP0603-CAP  [0603C]
C83  100n  CAP0402-CAP  [0402C]
C84  10n  CAP0402-CAP  [0402C]
C85  100n  CAP0603-CAP  [0603C]
C86  100n  CAP0603-CAP  [0603C]
C87  100pF  CAP0603-CAP  [0603C]
C88  100pF  CAP0603-CAP  [0603C]
C89  1u  CAP0603-CAP  [0603C]
C90  1u  CAP0603-CAP  [0603C]
C91  10u  CAP0603-CAP  [0603C]
C92  100n  CAP0402-CAP  [0402C]
C93  100n  CAP0402-CAP  [0402C]
C94  100n  CAP0402-CAP  [0402C]
C95  10u  CAP0603-CAP  [0603C]
C96  100n  CAP0402-CAP  [0402C]
C97  10n  CAP0402-CAP  [0402C]
C98  100n  CAP0402-CAP  [0402C]
C99  10n  CAP0402-CAP  [0402C]
C100  100n  CAP0402-CAP  [0402C]
C110  1u  CAP0603-CAP  [0603C]
C111  1u  CAP0603-CAP  [0603C]
C112  10n, COG  CAP0402-CAP  [0402C]
C113  100n  CAP0402-CAP  [0402C]
C114  100n  CAP0402-CAP  [0402C]
D1  D_ACACSOT23  [SOT-23]
L7  1k/500mA  FERRITE-0603  [FB603]
L8  1k/500mA  FERRITE-0603  [FB603]
L9  1k/500mA  FERRITE-0603  [FB603]
L11  120nH  INDUCTOR0603  [0603]
R44  274R  RES0603-RES  [0603R]
R45  10k  RES0603-RES  [0603R]
R46  33R,0.5%  RES0603-RES  [0603R]
R47  33R,0.5%  RES0603-RES  [0603R]
R48  1k  RES0402-RES  [0402R]
R49  1k  RES0402-RES  [0402R]
R50  1k  RES0402-RES  [0402R]
R51  1k  RES0402-RES  [0402R]
R52  2k  RES0603-RES  [0603R]
R53  2k  RES0603-RES  [0603R]
R54  100R  RES0603-RES  [0603R]
R55  2k  RES0603-RES  [0603R]
R56  1k  RES0603-RES  [0603R]
U3  AD8331  [QSOP20]
U4  AD9215BRUZ  [TSSOP28]
U10  LP3985IM5-3.0  V_REG_LDOSMD  [SOT23-5]

### Nets
+5VCLEAN: L7.1 L8.1 ; also sheet 3
ADC_CLK: R54.2 U4.13(CLK) ; also sheet 5
ADC_D0: U4.17(D0) ; also sheet 5
ADC_D1: U4.18(D1) ; also sheet 5
ADC_D2: U4.19(D2) ; also sheet 5
ADC_D3: U4.20(D3) ; also sheet 5
ADC_D4: U4.21(D4) ; also sheet 5
ADC_D5: U4.22(D5) ; also sheet 5
ADC_D6: U4.25(D6) ; also sheet 5
ADC_D7: U4.26(D7) ; also sheet 5
ADC_D8: U4.27(D8) ; also sheet 5
ADC_D9: U4.28(D9) ; also sheet 5
ADC_OR: U4.1(OR) ; also sheet 5
ADC_VCC: C97.1 C98.1 C99.1 C100.1 C111.2 C113.2 R49.2 R51.1 R55.2 U4.7(AVDD) U4.12(AVDD) U10.5(OUT)
ANIN: L11.1 ; also sheet 8
GND: C69.1 C72.1 C73.1 C74.1 C75.1 C76.1 C77.1 C78.1 C79.1 C80.1 C81.1 C82.1 C83.1 C84.1 C87.1 C88.2 C89.1 C90.1 C93.2 C94.2 C95.1 C96.1 C97.2 C98.2 C99.2 C100.2 C110.1 C111.1 C112.1 C113.1 C114.1 D1.2(C) R45.1 R48.2 R50.1 R54.1 R56.1 U3.6(COML) U3.9(MODE) U3.17(COMM) U3.20(COMM) U4.3(SENSE) U4.8(AGND) U4.11(AGND) U4.14(PDWN) U4.23(DRGND) U10.2(GND) ; also sheet 2,3,4,5,7,8
N$40: C68.1 L11.2
N$41: C110.2 L9.2 U10.1(IN) U10.3(EN)
N$45: C112.2 U10.4(BP)
N$112: C67.2 C68.2 C69.2 U3.2(INH)
N$113: C70.2 R44.2 U3.4(LON)
N$116: C67.1 R44.1
N$117: C70.1 U3.8(VIN)
N$118: C71.2 U3.5(LOP)
N$119: C74.2 C75.2 R45.2 U3.12(RCLMP)
N$120: C72.2 C73.2 U3.11(VCM)
N$121: C79.2 U3.1(LMD)
N$122: C89.2 D1.3(A) R52.2 U3.10(GAIN)
N$123: C80.2 C81.2 C82.2 L8.2 U3.3(VPSL) U3.18(ENBV) U3.19(ENBL)
N$124: C71.1 U3.7(VIP)
N$125: C76.2 C77.2 C78.2 L7.2 U3.14(VPOS)
N$126: C87.2 R46.2 R48.1 R49.1 U4.9(VIN+)
N$127: C88.1 R47.2 R50.2 R51.2 U4.10(VIN-)
N$128: C85.2 U3.15(VOH)
N$129: C86.2 U3.16(VOL)
N$130: C85.1 R46.1
N$131: C86.1 R47.1
N$132: C91.2 C92.2 C93.1 U4.5(REFB)
N$133: C91.1 C92.1 C94.1 U4.6(REFT)
N$134: C90.2 R52.1 R53.2
N$136: C95.2 C96.2 U4.4(VREF)
N$137: R55.1 R56.2 U4.2(MODE)
VCCIO [power]: C83.2 C84.2 C114.2 L9.1 U4.24(DRVDD) ; also sheet 2,3,4,5,7,8
VGA_GAIN: R53.1 ; also sheet 5
VGA_HILOW: U3.13(HILO) ; also sheet 5
Unconnected: D1.1(CA)

### Buses
ADC_D[0..9]

### Notes on the sheet
- ADC Power Supply V.Reg

## Sheet 7 of 8
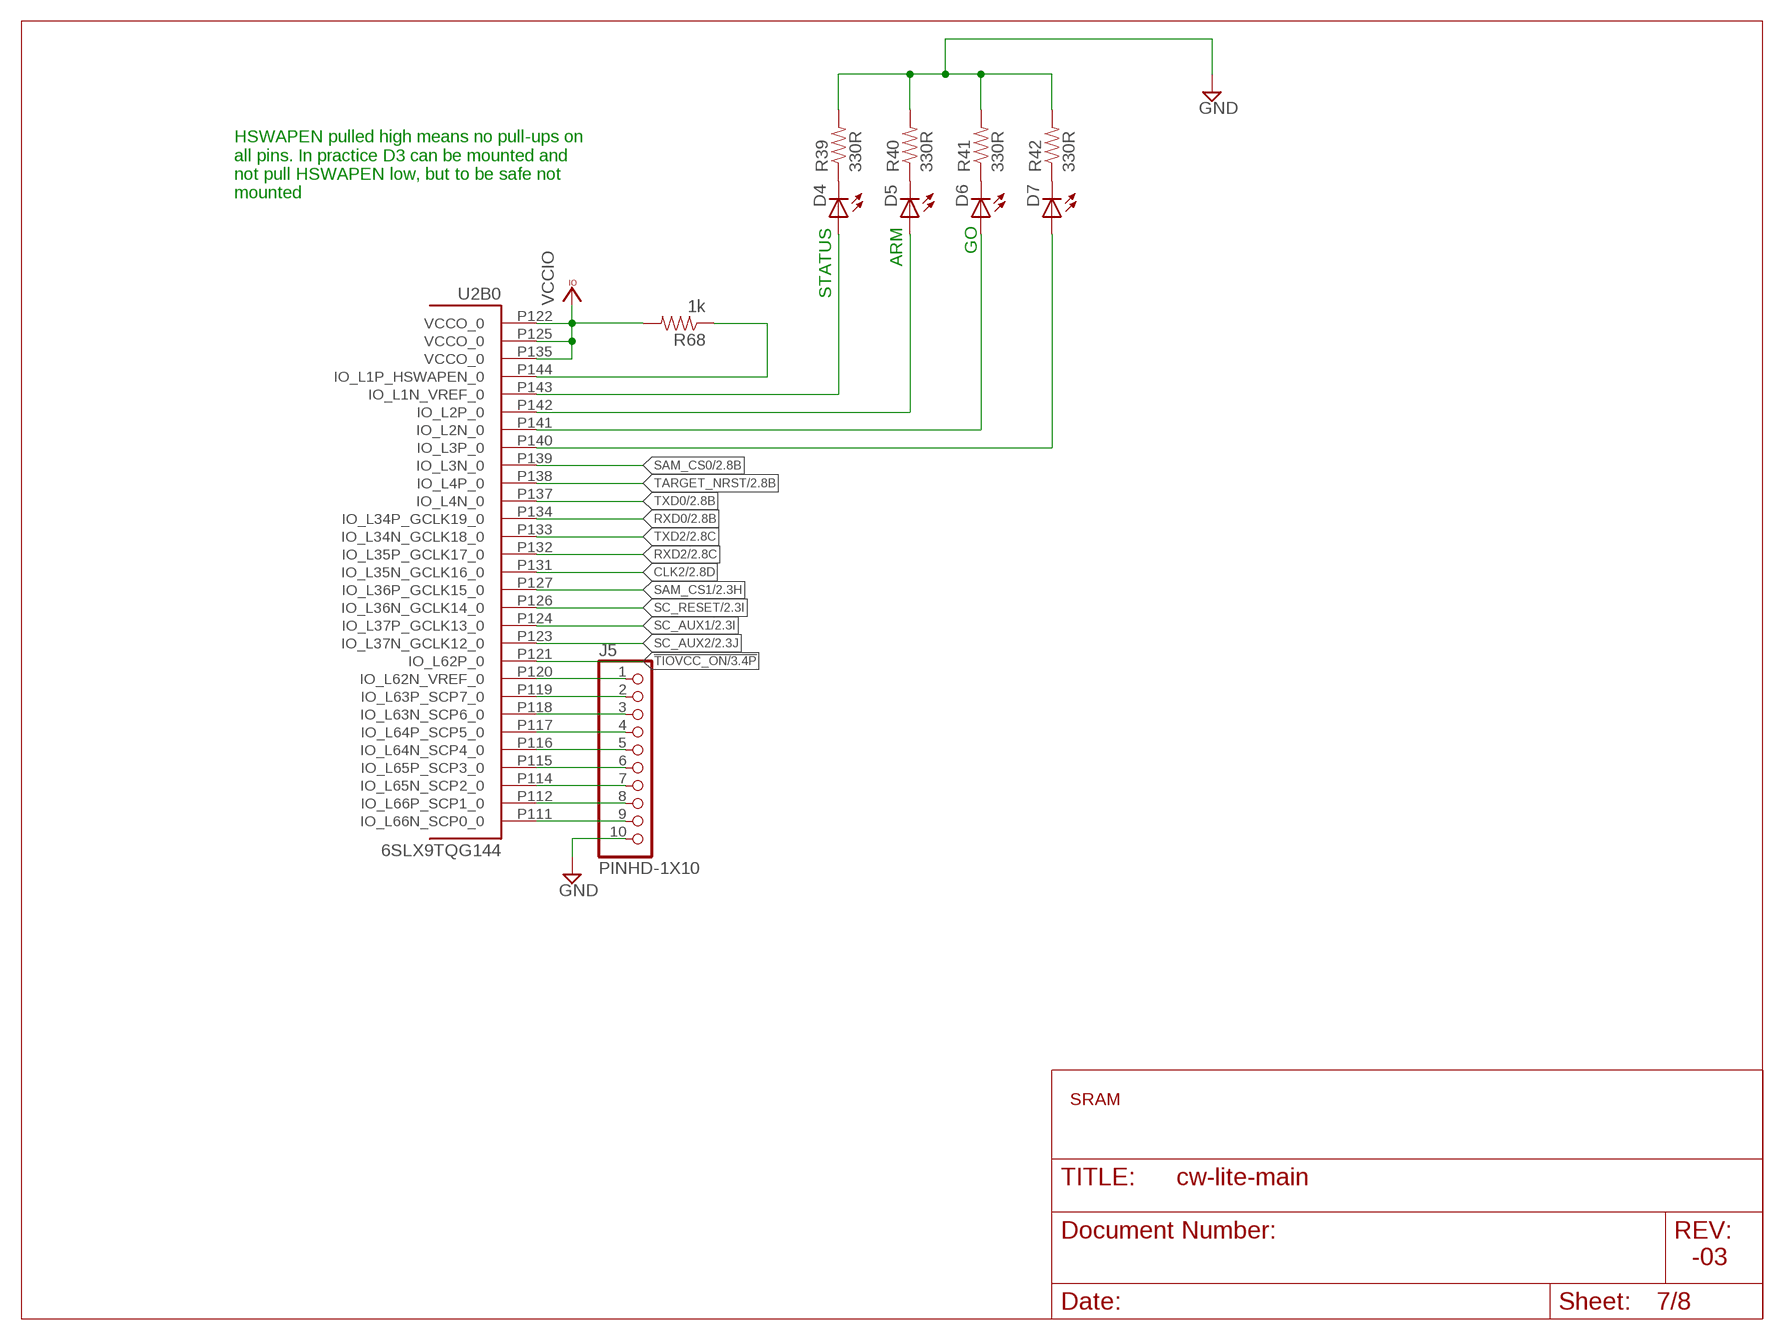
[diagram p6: schematic, sheet 7]

### Parts
D4  LED0603  [LED-0603]
D5  LED0603  [LED-0603]
D6  LED0603  [LED-0603]
D7  LED0603  [LED-0603]
J5  PINHD-1X10  [1X10-BIG]  (not fitted in variant normal)
R39  330R  RES0402-RES  [0402R]
R40  330R  RES0402-RES  [0402R]
R41  330R  RES0402-RES  [0402R]
R42  330R  RES0402-RES  [0402R]
R68  1k  RES0402-RES  [0402R]

### Nets
!TIOVCC_ON: U2.P121(B0:IO_L62P_0) ; also sheet 3
CLK2: U2.P131(B0:IO_L35N_GCLK16_0) ; also sheet 2
GND: J5.10 R39.2 R40.2 R41.2 R42.2 ; also sheet 2,3,4,5,6,8
LED_ARMED: D6.A U2.P141(B0:IO_L2N_0)
LED_CAPTURE: D5.A U2.P142(B0:IO_L2P_0)
LED_STATUS: R68.1 U2.P144(B0:IO_L1P_HSWAPEN_0)
LED_TCLOCK: D7.A U2.P140(B0:IO_L3P_0)
LED_USBACT: D4.A U2.P143(B0:IO_L1N_VREF_0)
N$19: J5.1 U2.P120(B0:IO_L62N_VREF_0)
N$96: J5.2 U2.P119(B0:IO_L63P_SCP7_0)
N$97: J5.3 U2.P118(B0:IO_L63N_SCP6_0)
N$98: J5.4 U2.P117(B0:IO_L64P_SCP5_0)
N$99: J5.5 U2.P116(B0:IO_L64N_SCP4_0)
N$101: J5.6 U2.P115(B0:IO_L65P_SCP3_0)
N$102: J5.7 U2.P114(B0:IO_L65N_SCP2_0)
N$103: J5.8 U2.P112(B0:IO_L66P_SCP1_0)
N$104: J5.9 U2.P111(B0:IO_L66N_SCP0_0)
N$106: D4.C R39.1
N$107: D5.C R40.1
N$108: D6.C R41.1
N$109: D7.C R42.1
RXD0: U2.P134(B0:IO_L34P_GCLK19_0) ; also sheet 2
RXD2: U2.P132(B0:IO_L35P_GCLK17_0) ; also sheet 2
SAM_CS0: U2.P139(B0:IO_L3N_0) ; also sheet 2
SAM_CS1: U2.P127(B0:IO_L36P_GCLK15_0) ; also sheet 2
SC_AUX1: U2.P124(B0:IO_L37P_GCLK13_0) ; also sheet 2
SC_AUX2: U2.P123(B0:IO_L37N_GCLK12_0) ; also sheet 2
SC_RESET: U2.P126(B0:IO_L36N_GCLK14_0) ; also sheet 2
TARGET_NRST: U2.P138(B0:IO_L4P_0) ; also sheet 2
TXD0: U2.P137(B0:IO_L4N_0) ; also sheet 2
TXD2: U2.P133(B0:IO_L34N_GCLK18_0) ; also sheet 2
VCCIO [power]: R68.2 U2.P122(B0:VCCO_0) U2.P125(B0:VCCO_0) U2.P135(B0:VCCO_0) ; also sheet 2,3,4,5,6,8

### Notes on the sheet
- HSWAPEN pulled high means no pull-ups on
  all pins. In practice D3 can be mounted and
  not pull HSWAPEN low, but to be safe not
  mounted
- GO
- ARM
- STATUS
- SRAM

## Sheet 8 of 8
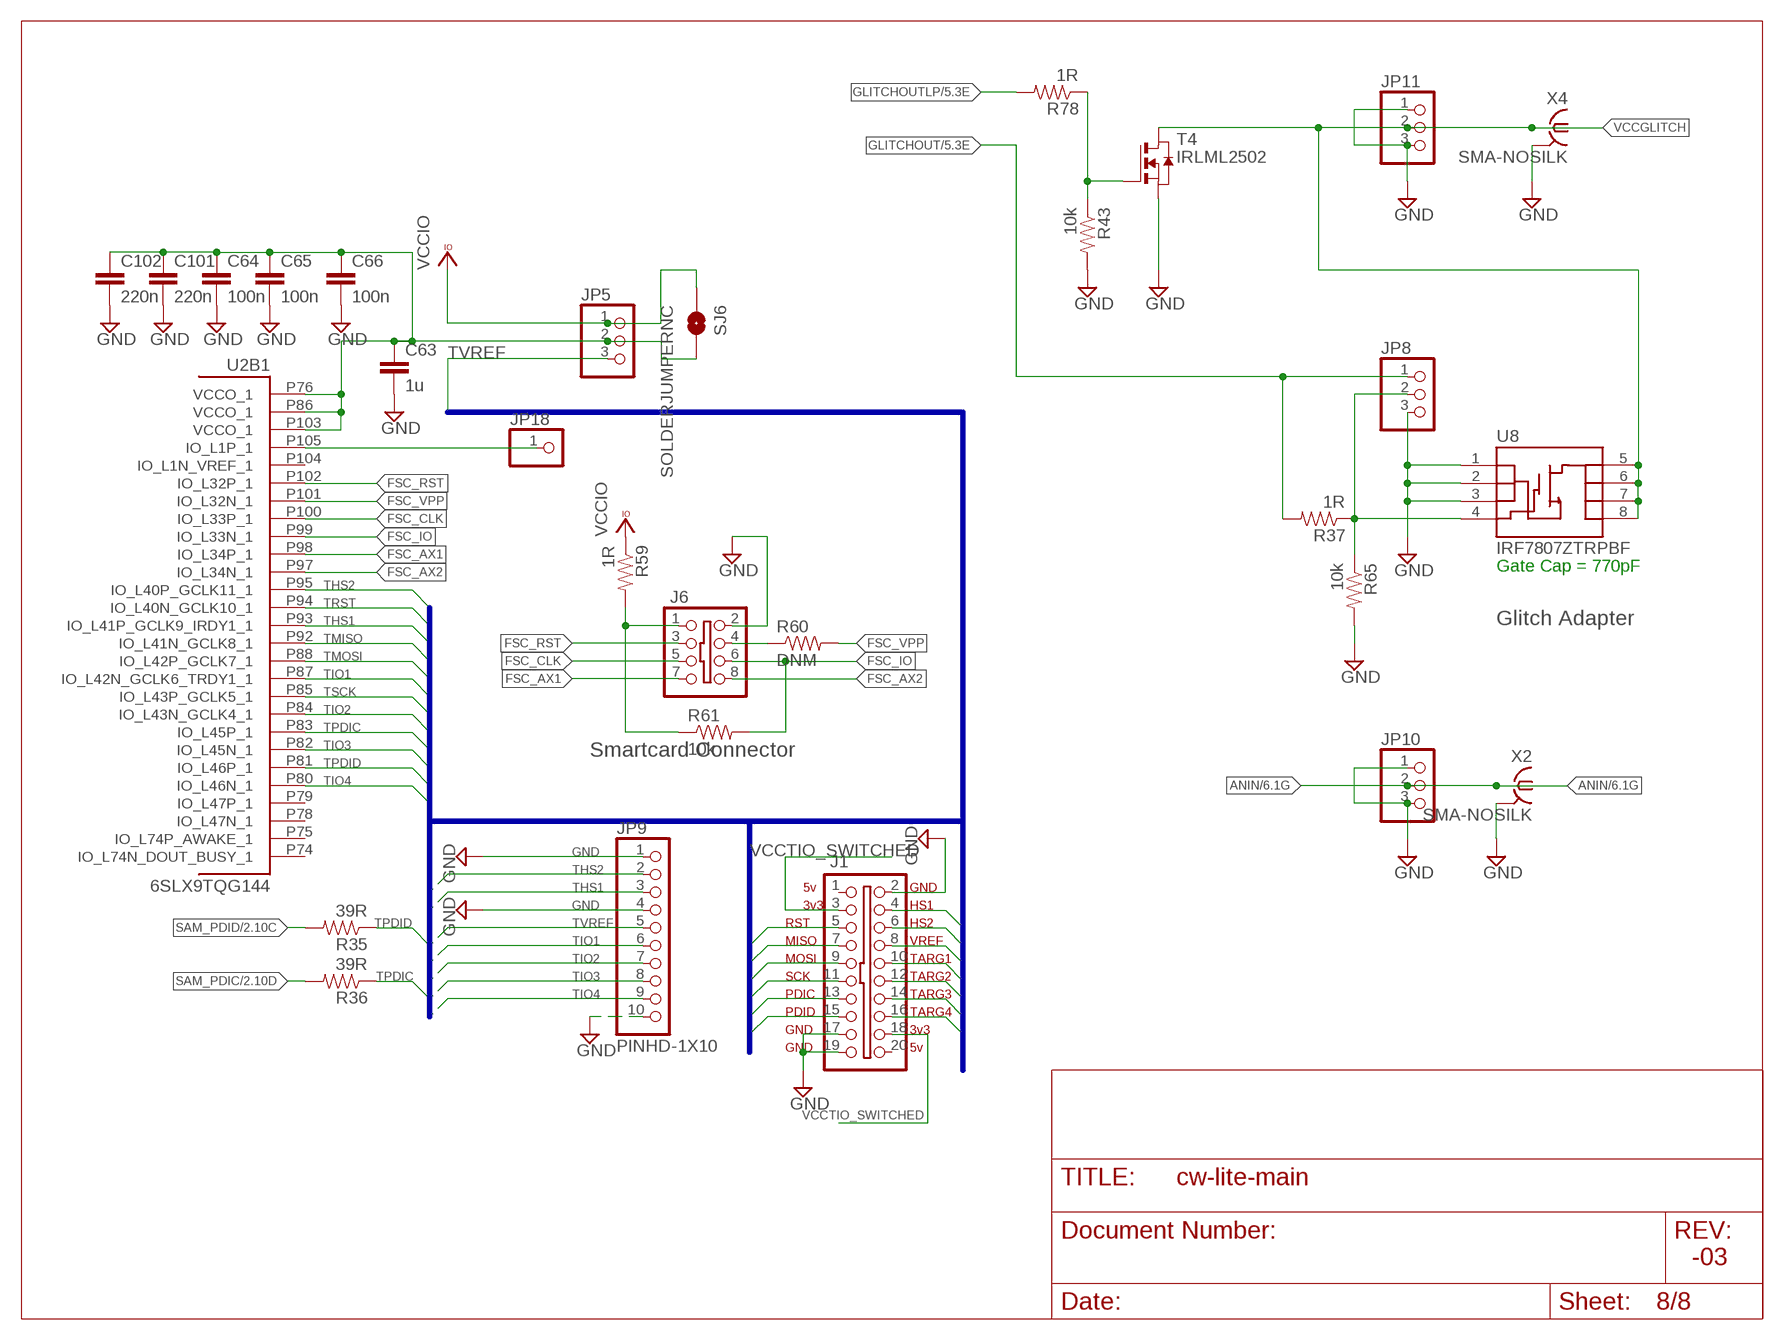
[diagram p7: schematic, sheet 8]

### Parts
C63  1u  CAP0603-CAP  [0603C]
C64  100n  CAP0402-CAP  [0402C]
C65  100n  CAP0402-CAP  [0402C]
C66  100n  CAP0402-CAP  [0402C]
C101  220n  CAP0402-CAP  [0402C]
C102  220n  CAP0402-CAP  [0402C]
J1  SHROUD_2X10-SHROUDED  [PINSHRD_PTH_2X10]  (not fitted in variant normal)
J6  SHROUD_2X4SHROUD  [PINSHRD_PTH_2X04]  (not fitted in variant normal)
JP5  PINHD-1X3  [1X03]  (not fitted in variant normal)
JP8  PINHD-1X3  [1X03]  (not fitted in variant normal)
JP9  PINHD-1X10  [1X10-BIG]  (not fitted in variant normal)
JP10  PINHD-1X3  [1X03]  (not fitted in variant normal)
JP11  PINHD-1X3  [1X03]  (not fitted in variant normal)
JP18  PINHD-1X1  [1X01]
R35  39R  RES0603-RES  [0603R]
R36  39R  RES0603-RES  [0603R]
R37  1R  RES0603-RES  [0603R]
R43  10k  RES0603-RES  [0603R]
R59  1R  RES0603-RES  [0603R]
R60  DNM  RES0603-RES  [0603R]  (not fitted in variant normal)
R61  10k  RES0603-RES  [0603R]
R65  10k  RES0603-RES  [0603R]
R78  1R  RES0603-RES  [0603R]
SJ6  SOLDERJUMPERNC  [SJ_2S]
T4  IRLML2502  NMOSSOT23  [SOT-23]
U8  IRF7807ZTRPBF  MOSFET-NCHANNEL-SOIC8  [SO08]
X2  SMA-NOSILK  [J502-ND-142-0711-821/826-NOSILK]  (not fitted in variant normal)
X4  SMA-NOSILK  [J502-ND-142-0711-821/826-NOSILK]  (not fitted in variant normal)

### Nets
ANIN: JP10.2 X2.1 ; also sheet 6
FSC_AX1: J6.7 U2.P98(B1:IO_L34P_1)
FSC_AX2: J6.8 U2.P97(B1:IO_L34N_1)
FSC_CLK: J6.5 U2.P100(B1:IO_L33P_1)
FSC_IO: J6.6 R61.2 U2.P99(B1:IO_L33N_1)
FSC_RST: J6.3 U2.P102(B1:IO_L32P_1)
FSC_VPP: R60.2 U2.P101(B1:IO_L32N_1)
GLITCHOUT: JP8.1 R37.2 ; also sheet 5
GLITCHOUTLP: R78.2 ; also sheet 5
GND: C63.2 C64.2 C65.2 C66.2 C101.2 C102.2 J1.2 J1.17 J1.19 J6.2 JP8.3 JP9.1 JP9.4 JP9.10 JP10.1 JP10.3 JP11.1 JP11.3 R43.2 R65.2 T4.2(S) U8.1(S) U8.2(S) U8.3(S) X2.G@1 X2.G@2 X2.G@3 X2.G@4 X4.G@1 X4.G@2 X4.G@3 X4.G@4 ; also sheet 2,3,4,5,6,7
N$42: JP8.2 R37.1 R65.1 U8.4(G)
N$62: JP18.1 U2.P105(B1:IO_L1P_1)
N$63: R43.1 R78.1 T4.3(G)
N$140: J6.1 R59.2 R61.1
N$146: J6.4 R60.1
SAM_PDIC: R36.2 ; also sheet 2
SAM_PDID: R35.2 ; also sheet 2
TARGET_VCCIO [power]: C63.1 C64.1 C65.1 C66.1 C101.1 C102.1 JP5.2 SJ6.2 U2.P76(B1:VCCO_1) U2.P86(B1:VCCO_1) U2.P103(B1:VCCO_1)
THS1: J1.4 JP9.3 U2.P93(B1:IO_L41P_GCLK9_IRDY1_1)
THS2: J1.6 JP9.2 U2.P95(B1:IO_L40P_GCLK11_1)
TIO1: J1.10 JP9.6 U2.P87(B1:IO_L42N_GCLK6_TRDY1_1)
TIO2: J1.12 JP9.7 U2.P84(B1:IO_L43N_GCLK4_1)
TIO3: J1.14 JP9.8 U2.P82(B1:IO_L45N_1)
TIO4: J1.16 JP9.9 U2.P80(B1:IO_L46N_1)
TMISO: J1.7 U2.P92(B1:IO_L41N_GCLK8_1)
TMOSI: J1.9 U2.P88(B1:IO_L42P_GCLK7_1)
TPDIC: J1.13 R36.1 U2.P83(B1:IO_L45P_1)
TPDID: J1.15 R35.1 U2.P81(B1:IO_L46P_1)
TRST: J1.5 U2.P94(B1:IO_L40N_GCLK10_1)
TSCK: J1.11 U2.P85(B1:IO_L43P_GCLK5_1)
TVREF: J1.8 JP5.3 JP9.5
VCCGLITCH: JP11.2 T4.1(D) U8.5(D) U8.6(D) U8.7(D) U8.8(D) X4.1
VCCIO [power]: JP5.1 R59.1 SJ6.1 ; also sheet 2,3,4,5,6,7
VCCTIO_SWITCHED [power]: J1.3 J1.18 ; also sheet 3
Unconnected: J1.1 J1.20 U2.P74(B1:IO_L74N_DOUT_BUSY_1) U2.P75(B1:IO_L74P_AWAKE_1) U2.P78(B1:IO_L47N_1) U2.P79(B1:IO_L47P_1) U2.P104(B1:IO_L1N_VREF_1)

### Buses
TRST,TMISO,TMOSI,TSCK,TPDIC,TPDID,THS1,THS2,TVREF,TIO1,TIO2,TIO3,TIO4

### Notes on the sheet
- Gate Cap = 770pF
- Glitch Adapter
- Smartcard Connector
- 5v | GND
- 3v3 | HS1
- RST | HS2
- MISO | VREF
- MOSI | TARG1
- SCK | TARG2
- PDIC | TARG3
- PDID | TARG4
- GND | 3v3
- GND | 5v

## Library data of the parts
C1 C2 C4 C8-C25 C28-C33 C49-C51 C123 = custom-rcl:CAP: Capacitor Standard 0603 ceramic capacitor, and 0.1" leaded capacitor.
C3 C6 C7 = custom-rcl:CAP: Capacitor Standard 0603 ceramic capacitor, and 0.1" leaded capacitor.; OC_DIGIKEY: 90-3297-1-ND
C5 C26 C27 = custom-rcl:CAP: Capacitor Standard 0603 ceramic capacitor, and 0.1" leaded capacitor.; OC_DIGIKEY: 490-1552-1-ND
C34-C36 C38 C39 C41-C44 C46-C48 C52-C59 C64-C77 C79-C81 C83-C88 C91-C102 C112-C114 = custom-std:CAP: Capacitor Standard 0603 ceramic capacitor, and 0.1" leaded capacitor.
C40 = custom-std:CAP: Capacitor Standard 0603 ceramic capacitor, and 0.1" leaded capacitor.; OC_DIGIKEY: 490-1552-1-ND
C45 C60-C63 C78 C82 C89 C90 C110 C111 C122 = custom-std:CAP: Capacitor Standard 0603 ceramic capacitor, and 0.1" leaded capacitor.; OC_DIGIKEY: 490-1550-1-ND
D1 = zetex:D_ACAC: Dual DIODE; MPN: BAV99-7F; OC_FARNELL: unknown; OC_NEWARK: unknown
D2 D4-D7 D9 = SparkFun:LED: LEDs Standard schematic elements and footprints for 5mm, 3mm, 1206, and 0603 sized LEDs. 5mm - Spark Fun Electronics SKU : COM-00529 (and others)
FID1-FID6 MFID1-MFID4 = SparkFun:FIDUCIAL: Fiducial Alignment Points Various fiducial points for machine vision alignment.
H1-H4 = holes:MOUNT-PAD-ROUND: MOUNTING PAD, round
J1 J3 = custom-std:SHROUD_2X10
J4 = dp_devices:CON_HEADER_PRG_XILINX_JTAG6: 6-pin Xilinx JTAG programming header
J5 JP9 = adafruit:PINHD-1X10: Pin header 1x10 0.1" spacing With round pins
J6 J7 = custom-std:SHROUD_2X4: 2x05 pin header
J8 = customs:MICRO-USB-5P: When you use the footprint ,place notice 46 (layer)milling ,there is some important information. Example Part: ZX62D-B-5P8; MPN: ZX62D-B-5P8; OC_DIGIKEY: H11610CT-ND
JP1 = pinhead:PINHD-1X4: PIN HEADER
JP2-JP4 = pinhead:PINHD-1X2: PIN HEADER
JP5 = pinhead:PINHD-1X3: PIN HEADER
JP8 JP10 JP11 = adafruit:PINHD-1X3: PIN HEADER
JP18 = pinhead:PINHD-1X1: PIN HEADER
L1 = SparkFun:INDUCTOR: Inductors Basic Inductor/Choke - 0603 and 1206. Footprints are not proven and vary greatly between part numbers.; OC_DIGIKEY: 535-12537-1-ND
L2 = Bogdan_Commons:L: INDUCTOR, European symbol; OC_DIGIKEY: 445-6677-1-ND
L3 = Bogdan_Commons:L: INDUCTOR, European symbol; MPN: VLS3015ET-3R3M; OC_DIGIKEY: 445-6677-1-ND
L4 L6 = dp_devices:FERRITE: Ferrite bead in various packages; OC_DIGIKEY: 732-1593-1-ND
L5 L7-L9 = dp_devices:FERRITE: Ferrite bead in various packages; OC_DIGIKEY: 587-1739-1-ND
L11 = SparkFun:INDUCTOR: Inductors Basic Inductor/Choke - 0603 and 1206. Footprints are not proven and vary greatly between part numbers.
Q1 = customs:XTAL-4: Classic 4-pin 3.2 x 2.5mm crystal; MPN: ABM8G-12.000MHZ-4Y-T3; OC_DIGIKEY: 535-10901-1-ND
R1-R12 R14 R15 R22 R27-R29 R57 R58 R62-R64 R69-R71 = custom-rcl:RES: Resistor Basic schematic elements and footprints for 0603, 1206, and PTH resistors.
R16 = custom-rcl:RES: Resistor Basic schematic elements and footprints for 0603, 1206, and PTH resistors.; OC_DIGIKEY: RHM1.00KCDCT-ND
R17-R21 = custom-rcl:RES: Resistor Basic schematic elements and footprints for 0603, 1206, and PTH resistors.; OC_DIGIKEY: RHM100KCDCT-ND
R23-R26 R30 R35-R37 R39-R56 R59-R61 R65 R68 R78 R79 = custom-std:RES: Resistor Basic schematic elements and footprints for 0603, 1206, and PTH resistors.
R31 R77 = custom-std:RES: Resistor Basic schematic elements and footprints for 0603, 1206, and PTH resistors.; OC_DIGIKEY: RHM100KCDCT-ND
R33 = custom-std:RES: Resistor Basic schematic elements and footprints for 0603, 1206, and PTH resistors.; OC_DIGIKEY: RHM47.0KCDCT-ND
R34 = custom-std:RES: Resistor Basic schematic elements and footprints for 0603, 1206, and PTH resistors.; OC_DIGIKEY: RHM68KCDCT-ND
S1 = SparkFun:TAC_SWITCH: Momentary Switch Button commonly used for reset or general input. Spark Fun Electronics SKU : COM-00097
SJ1 = SparkFun:SOLDERJUMPER_2WAY: Solder Jumper 2 way solder jumper
SJ6 = SparkFun:SOLDERJUMPER: Solder Jumper Standard SMD solder jumper. Used to automate production. Two varients : Normally Open and Normally Closed are the same, but have different paste layers. NC will have a large amount of paste and should jumper during reflow.
T1 T3 = zetex:PMOSSOT23: MOS FET; MPN: IRLML6402TRPBF; OC_DIGIKEY: IRLML6402PBFCT-ND; OC_FARNELL: unknown; OC_NEWARK: unknown
T2 T4 = zetex:NMOSSOT23: MOS FET; MPN: IRLML2502TRPBF; OC_DIGIKEY: IRLML2502PBFCT-ND; OC_FARNELL: unknown; OC_NEWARK: unknown
U1 = Atmel_By_element14_Batch_1-00:ATSAM3U2CA-AU: AT91ARM Cortex M3-based Microcontrollers; DESCRIPTION: AT91ARM Cortex M3-based Microcontrollers; MPN: ATSAM3U2CA-AU; OC_DIGIKEY: ATSAM3U2CA-AU-ND; OC_FARNELL: 1841662; OC_NEWARK: 12T1318; PACKAGE: LQFP-100; SUPPLIER: Atmel Corporation
U2 = xilinx_devices_V6:6SLX9TQG144: Xilinx FPGA: 6SLX9TQG144; MPN: XC6SLX9-3TQG144C; OC_DIGIKEY: 122-1748-ND
U3 = customs:AD8331; MPN: AD8331ARQZ; OC_DIGIKEY: AD8331ARQZ-R7CT-ND
U4 = customs:AD9215BRUZ; MPN: AD9215BRUZ-105; OC_DIGIKEY: AD9215BRUZ-105-ND
U5 = Bogdan_Commons:LTC3419: Dual Monolithic 600mA Synchronous Step-Down Regulator; MPN: LTC3419EMS#PBF; OC_DIGIKEY: LTC3419EMS#PBF-ND
U6 = customs:PRTR5V0U2AX; MPN: PRTR5V0U2AX,215; OC_DIGIKEY: 568-4139-1-ND
U7 = SparkFun-PowerIC:V_REG_MIC2920: MIC2920A (http://www.micrel.com/_PDF/mic2920.pdf) - 400mA output LDO Regulator; MPN: TC1262-3.3VDBTR; OC_DIGIKEY: TC1262-3.3VDBCT-ND
U8 = SparkFun:MOSFET-NCHANNEL-SOIC8: N-Channel MOSFET IRF9410 and NDS8434 are common, SOIC-8 parts.
U9 = SparkFun:SPI_FLASH-X25XX: 8pin SPI Flash series x25xx. Works with devices like W25X32 and BR25L32
U10 = SparkFun:V_REG_LDO: Voltage Regulator LDO Standard 150mA LDO voltage regulator in SOT-23 layout. Micrel part MIC5205. BP (by-pass) pin is used to lower output noise with 470pF cap.; MPN: LP3985IM5X-3.0/NOPB; OC_DIGIKEY: LP3985IM5X-3.0/NOPBCT-ND
X2 X4 = custom-std:SMA-: SMA 50 Ohm End Launch Jack Receptacle - Round Contact Johnson Components Source: www.johnsoncomponents.com .. J502-ND.pdf

## Net classes
0 default: width 0.152 mm
1 USB Differential: width 0.191 mm, clearance 0.191 mm
2 power: width 0.254 mm